# EasyEDA Pro project kod-01-akdk.eprj, board kod-01-right-pcb
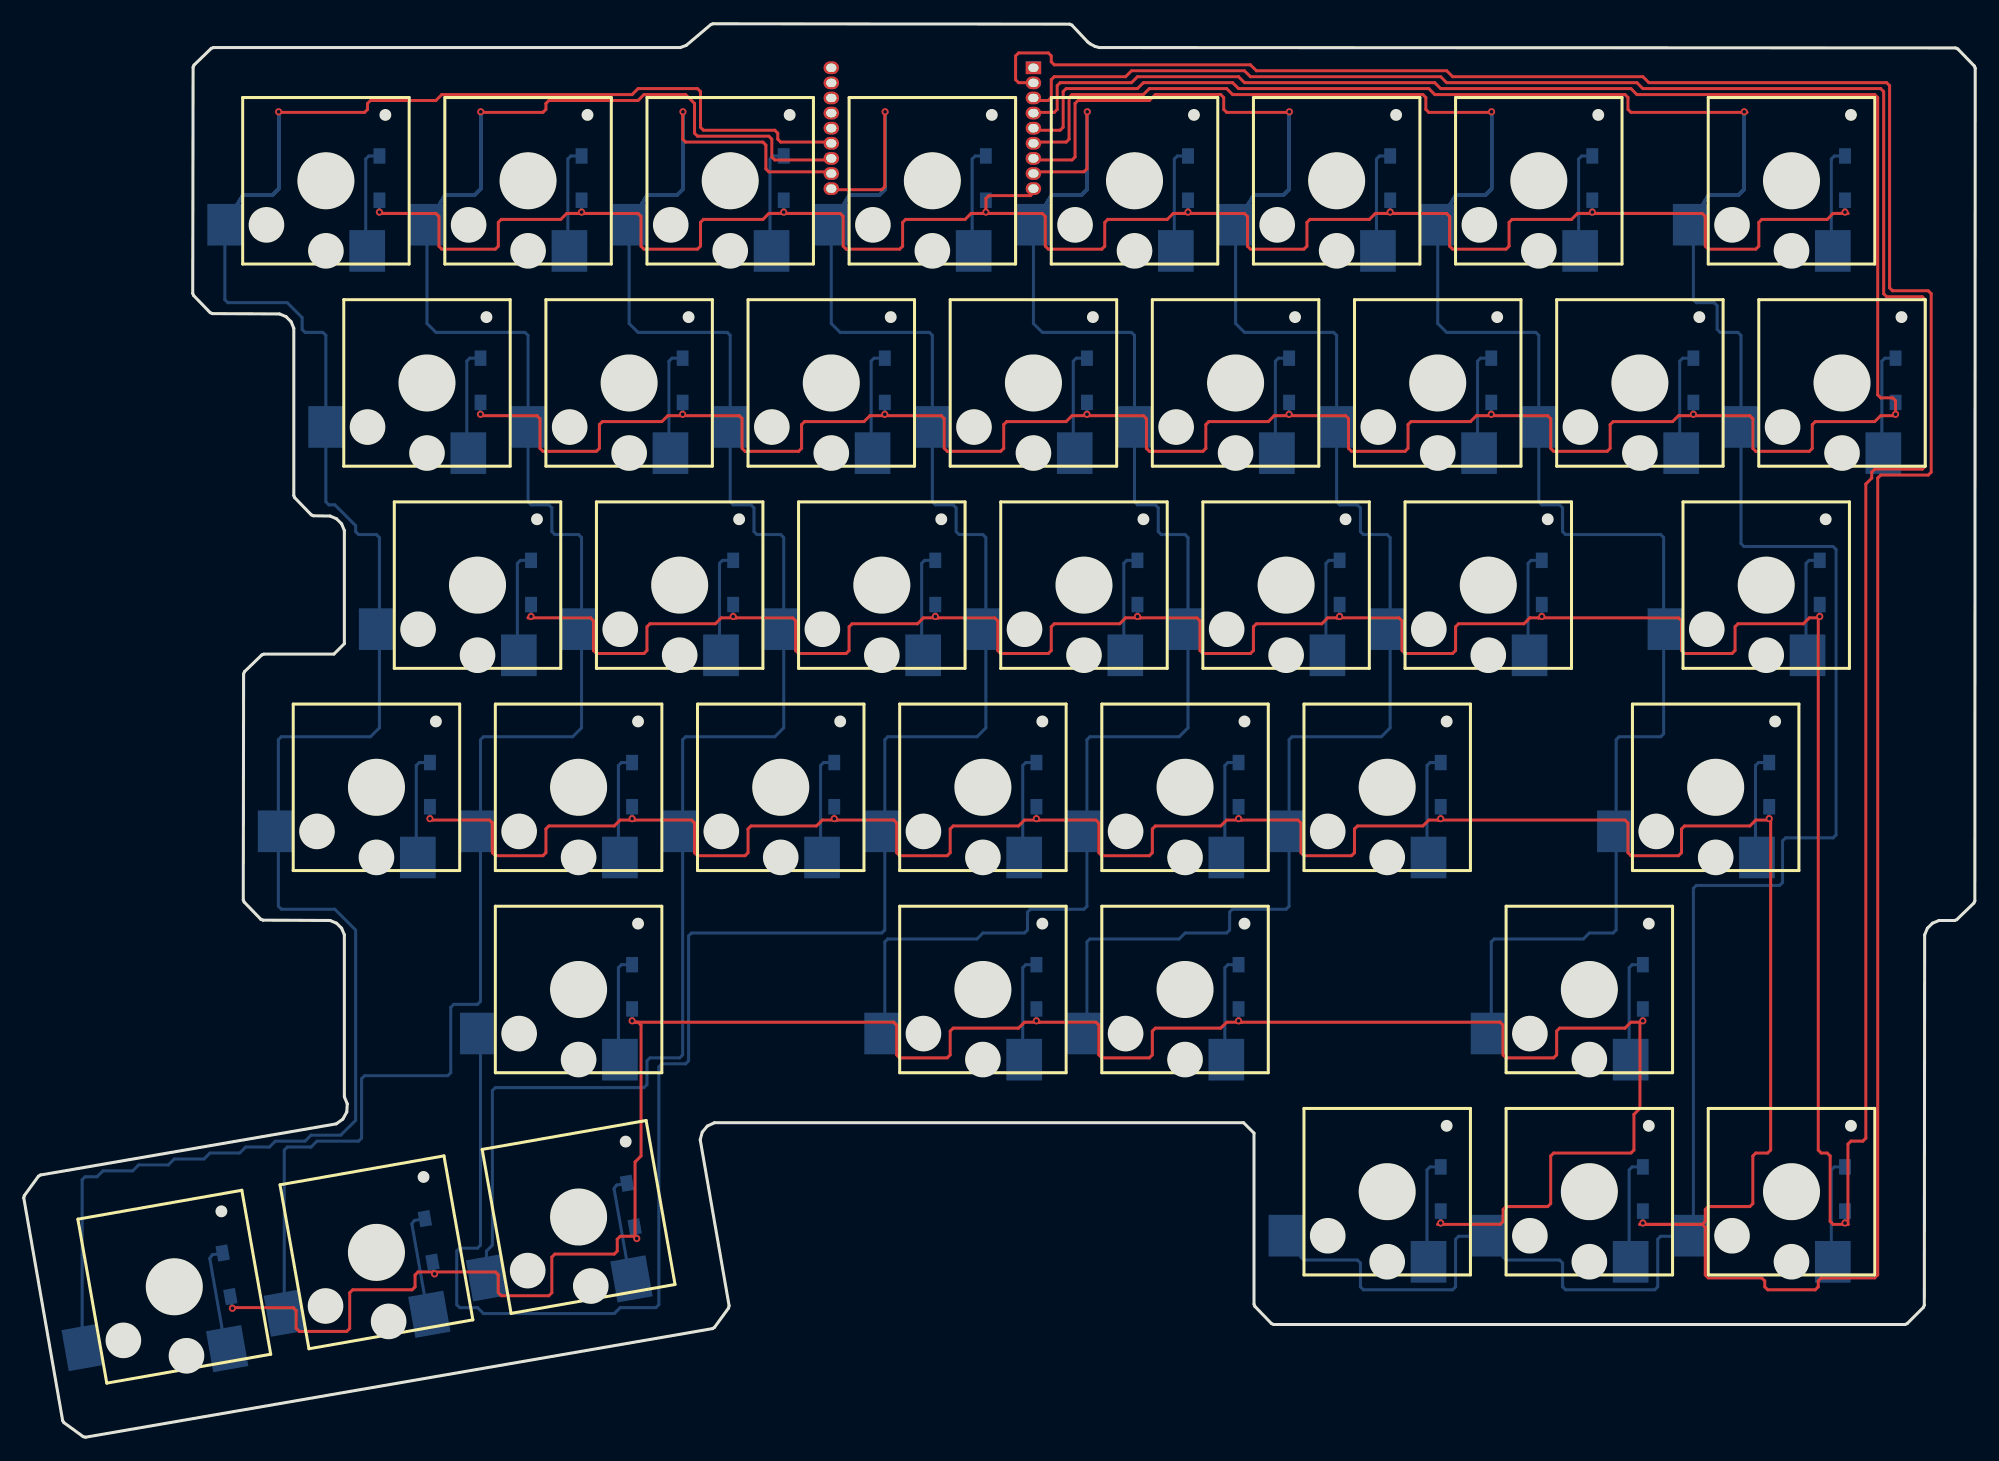
[diagram p2: board, top side]
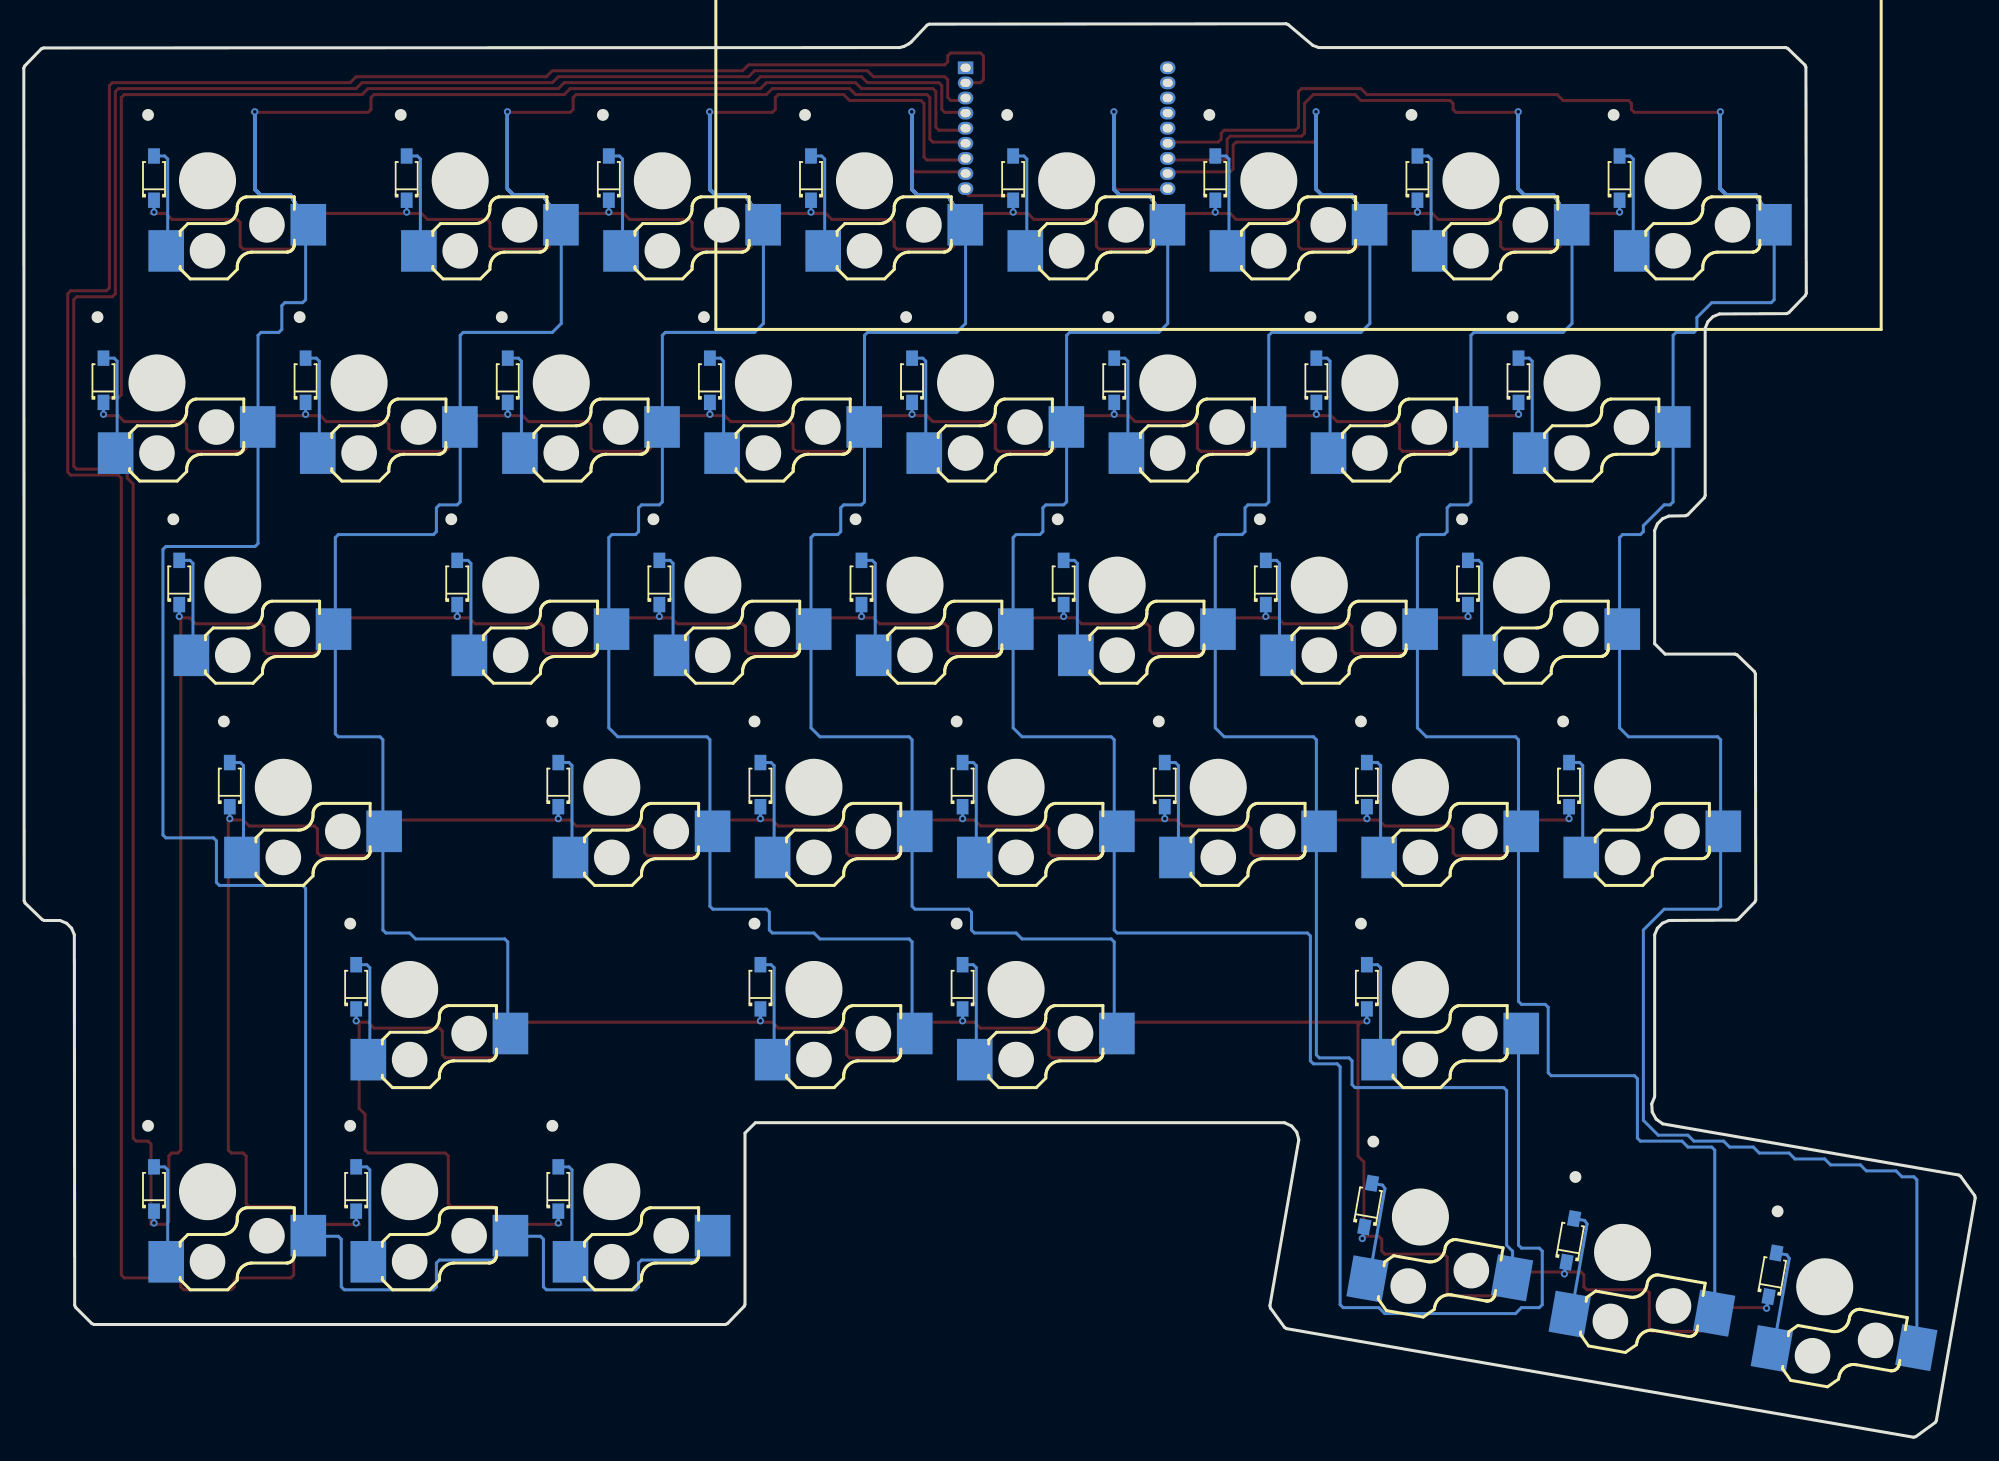
[diagram p3: board, bottom side, seen from below]

Outline 164.11 x 118.85 mm; copper layers: Top Layer, Bottom Layer. Coordinates in mm from the lower left corner of the outline.
Outline path: 0,20.12 0.05,20.32 1.23,21.94 1.4,22.05 26.27,26.35 26.83,26.74 27.16,27.35 27.2,28.03 26.98,28.58 26.96,28.68 26.96,42.24 26.73,42.8 26.3,43.22 25.76,43.45 20.11,43.48 19.93,43.56 18.53,45 18.46,45.18 18.49,64.19 18.57,64.38 20.01,65.77 20.19,65.85 26.08,65.85 26.96,66.72 26.96,76.24 26.73,76.8 26.3,77.23 25.76,77.45 24.36,77.48 24.18,77.56 22.78,79 22.71,79.18 22.71,93.24 22.48,93.8 22.05,94.22 21.51,94.45 15.86,94.48 15.68,94.56 14.28,96 14.21,96.18 14.24,115.19 14.32,115.38 15.76,116.77 15.94,116.85 55.21,116.85 55.71,117.03 57.78,118.78 57.95,118.85 87.95,118.81 88.14,118.73 89.48,117.31 89.67,117.16 90.1,116.94 90.46,116.85 162.45,116.81 162.64,116.74 164.03,115.29 164.11,115.11 164.08,45.1 164,44.92 162.55,43.52 162.37,43.45 161.06,43.45 160.51,43.22 160.09,42.79 159.86,42.24 159.83,11.1 159.75,10.92 158.38,9.55 158.2,9.48 105.11,9.48 104.93,9.56 103.53,11 103.46,11.18 103.46,25.57 102.58,26.45 58.09,26.45 57.48,26.16 57.06,25.65 56.88,25.01 59.31,11.06 59.27,10.86 58.08,9.23 57.92,9.13 5.19,0 5,0.05 3.37,1.23 3.27,1.39 0,20.12

## Design rules (mm)
spacing Default (default): track to track 0.152, other pairs 0 to 0.152
track width Default (default): min 0.254, default 0.254, max 25.4
via Default (default): diameter min 0.61, default 0.61, max 100.025; hole min 0.305, default 0.305, max 59.995

## Placement (name value [footprint] x y rotation side)
D1  -  [1N4148W#2]  29.91 105.85 90 bottom
D2  -  [1N4148W#2]  46.91 105.85 90 bottom
D3  -  [1N4148W#2]  63.91 105.85 90 bottom
D4  -  [1N4148W#2]  80.91 105.85 90 bottom
D5  -  [1N4148W#2]  97.91 105.85 90 bottom
D6  -  [1N4148W#2]  114.91 105.85 90 bottom
D7  -  [1N4148W#2]  131.91 105.85 90 bottom
D8  -  [1N4148W#2]  153.16 105.85 90 bottom
D9  -  [1N4148W#2]  38.41 88.85 90 bottom
D10  -  [1N4148W#2]  55.41 88.85 90 bottom
D11  -  [1N4148W#2]  72.41 88.85 90 bottom
D12  -  [1N4148W#2]  89.41 88.85 90 bottom
D13  -  [1N4148W#2]  106.41 88.85 90 bottom
D14  -  [1N4148W#2]  123.41 88.85 90 bottom
D15  -  [1N4148W#2]  140.41 88.85 90 bottom
D16  -  [1N4148W#2]  157.41 88.85 90 bottom
D17  -  [1N4148W#2]  42.66 71.85 90 bottom
D18  -  [1N4148W#2]  59.66 71.85 90 bottom
D19  -  [1N4148W#2]  76.66 71.85 90 bottom
D20  -  [1N4148W#2]  93.66 71.85 90 bottom
D21  -  [1N4148W#2]  110.66 71.85 90 bottom
D22  -  [1N4148W#2]  127.66 71.85 90 bottom
D23  -  [1N4148W#2]  151.03 71.85 90 bottom
D24  -  [1N4148W#2]  153.16 20.85 90 bottom
D25  -  [1N4148W#2]  34.16 54.85 90 bottom
D26  -  [1N4148W#2]  51.16 54.85 90 bottom
D27  -  [1N4148W#2]  68.16 54.85 90 bottom
D28  -  [1N4148W#2]  85.16 54.85 90 bottom
D29  -  [1N4148W#2]  102.16 54.85 90 bottom
D30  -  [1N4148W#2]  119.16 54.85 90 bottom
D31  -  [1N4148W#2]  146.78 54.85 90 bottom
D32  -  [1N4148W#2]  136.16 20.85 90 bottom
D33  -  [1N4148W]  17.05 13.63 80 bottom
D34  -  [1N4148W]  34.05 16.52 80 bottom
D35  -  [1N4148W]  51.05 19.5 80 bottom
D36  -  [1N4148W#2]  51.16 37.85 90 bottom
D37  -  [1N4148W#2]  85.16 37.85 90 bottom
D38  -  [1N4148W#2]  102.16 37.85 90 bottom
D39  -  [1N4148W#2]  136.16 37.85 90 bottom
D40  -  [1N4148W#2]  119.16 20.85 90 bottom
SW1  -  [CPG135001S30]  22.91 100.85 180 bottom
SW2  -  [CPG135001S30]  39.91 100.85 180 bottom
SW3  -  [CPG135001S30]  56.91 100.85 180 bottom
SW4  -  [CPG135001S30]  73.91 100.85 180 bottom
SW5  -  [CPG135001S30]  90.91 100.85 180 bottom
SW6  -  [CPG135001S30]  107.91 100.85 180 bottom
SW7  -  [CPG135001S30]  124.91 100.85 180 bottom
SW8  -  [CPG135001S30]  146.16 100.85 180 bottom
SW9  -  [CPG135001S30]  31.41 83.85 180 bottom
SW10  -  [CPG135001S30]  48.41 83.85 180 bottom
SW11  -  [CPG135001S30]  65.41 83.85 180 bottom
SW12  -  [CPG135001S30]  82.41 83.85 180 bottom
SW13  -  [CPG135001S30]  99.41 83.85 180 bottom
SW14  -  [CPG135001S30]  116.41 83.85 180 bottom
SW15  -  [CPG135001S30]  133.41 83.85 180 bottom
SW16  -  [CPG135001S30]  150.41 83.85 180 bottom
SW17  -  [CPG135001S30]  35.66 66.85 180 bottom
SW18  -  [CPG135001S30]  52.66 66.85 180 bottom
SW19  -  [CPG135001S30]  69.66 66.85 180 bottom
SW20  -  [CPG135001S30]  86.66 66.85 180 bottom
SW21  -  [CPG135001S30]  103.66 66.85 180 bottom
SW22  -  [CPG135001S30]  120.66 66.85 180 bottom
SW23  -  [CPG135001S30]  144.03 66.85 180 bottom
SW24  -  [CPG135001S30]  146.16 15.85 180 bottom
SW25  -  [CPG135001S30]  27.16 49.85 180 bottom
SW26  -  [CPG135001S30]  44.16 49.85 180 bottom
SW27  -  [CPG135001S30]  61.16 49.85 180 bottom
SW28  -  [CPG135001S30]  78.16 49.85 180 bottom
SW29  -  [CPG135001S30]  95.16 49.85 180 bottom
SW30  -  [CPG135001S30]  112.16 49.85 180 bottom
SW31  -  [CPG135001S30]  139.78 49.85 180 bottom
SW32  -  [CPG135001S30]  129.16 15.85 180 bottom
SW33  -  [CPG135001S30#2]  11.03 7.49 170 bottom
SW34  -  [CPG135001S30#2]  28.03 10.38 170 bottom
SW35  -  [CPG135001S30#2]  45.03 13.36 170 bottom
SW36  -  [CPG135001S30]  44.16 32.85 180 bottom
SW37  -  [CPG135001S30]  78.16 32.85 180 bottom
SW38  -  [CPG135001S30]  95.16 32.85 180 bottom
SW39  -  [CPG135001S30]  129.16 32.85 180 bottom
SW40  -  [CPG135001S30]  112.16 15.85 180 bottom
U1  -  [MS88SF2_1-1-3-SIDE2]  84.91 115.15 0 bottom

## Footprints (pads in the part's own frame, mm; a bottom-side part is the same pattern mirrored in y, then rotated)
1N4148W
  rect 1.3x1 smd rot 20: 1(-1.724,0.627) 2(1.77,-0.644)
1N4148W#2
  rect 1.3x1 smd: 1(-1.835,0) 2(1.884,0)
CPG135001S30
  rect 3x3.5 smd: 1(5.975,1.1) 2(-5.975,-1.1)
CPG135001S30#2
  rect 3x3.5 smd rot 20: 1(5.991,-1.01) 2(-5.991,1.01)
MS88SF2_1-1-3-SIDE2
  rect 1.3x1.07 hole 0.85x0.7: 1(0,0)
  oval 1.3x1.07 hole 0.85x0.7: 2(0,1.27) 3(0,2.54) 4(0,3.81) 5(0,5.08) 6(0,6.35) 7(0,7.62) 8(0,8.89) 9(0,10.16) 10(-17,10.16) 11(-17,8.89) 12(-17,7.62) 13(-17,6.35) 14(-17,5.08) 15(-17,3.81) 16(-17,2.54) 17(-17,1.27) 18(-17,0)

## Nets
COL0: SW1.1 SW9.1 SW17.1 SW25.1 SW33.1 U1.13
COL1: SW2.1 SW10.1 SW18.1 SW26.1 SW34.1 U1.12
COL2: SW3.1 SW11.1 SW19.1 SW27.1 SW35.1 U1.11
COL3: SW4.1 SW12.1 SW20.1 SW28.1 SW36.1 U1.10
COL4: SW5.1 SW13.1 SW21.1 SW29.1 SW37.1 U1.8
COL5: SW6.1 SW14.1 SW22.1 SW30.1 SW38.1 U1.7
COL6: SW7.1 SW15.1 SW23.1 SW31.1 SW39.1 U1.6
COL7: SW8.1 SW16.1 SW24.1 SW32.1 SW40.1 U1.5
ROW0: D1.1 D2.1 D3.1 D4.1 D5.1 D6.1 D7.1 D8.1 U1.9
ROW1: D9.1 D10.1 D11.1 D12.1 D13.1 D14.1 D15.1 D16.1 U1.4
ROW2: D17.1 D18.1 D19.1 D20.1 D21.1 D22.1 D23.1 D24.1 U1.3
ROW3: D25.1 D26.1 D27.1 D28.1 D29.1 D30.1 D31.1 D32.1 U1.2
ROW4: D33.1 D34.1 D35.1 D36.1 D37.1 D38.1 D39.1 D40.1 U1.1
SW1_2: D1.2 SW1.2
SW2_2: D2.2 SW2.2
SW3_2: D3.2 SW3.2
SW4_2: D4.2 SW4.2
SW5_2: D5.2 SW5.2
SW6_2: D6.2 SW6.2
SW7_2: D7.2 SW7.2
SW8_2: D8.2 SW8.2
SW9_2: D9.2 SW9.2
SW10_2: D10.2 SW10.2
SW11_2: D11.2 SW11.2
SW12_2: D12.2 SW12.2
SW13_2: D13.2 SW13.2
SW14_2: D14.2 SW14.2
SW15_2: D15.2 SW15.2
SW16_2: D16.2 SW16.2
SW17_2: D17.2 SW17.2
SW18_2: D18.2 SW18.2
SW19_2: D19.2 SW19.2
SW20_2: D20.2 SW20.2
SW21_2: D21.2 SW21.2
SW22_2: D22.2 SW22.2
SW23_2: D23.2 SW23.2
SW24_2: D24.2 SW24.2
SW25_2: D25.2 SW25.2
SW26_2: D26.2 SW26.2
SW27_2: D27.2 SW27.2
SW28_2: D28.2 SW28.2
SW29_2: D29.2 SW29.2
SW30_2: D30.2 SW30.2
SW31_2: D31.2 SW31.2
SW32_2: D32.2 SW32.2
SW33_2: D33.2 SW33.2
SW34_2: D34.2 SW34.2
SW35_2: D35.2 SW35.2
SW36_2: D36.2 SW36.2
SW37_2: D37.2 SW37.2
SW38_2: D38.2 SW38.2
SW39_2: D39.2 SW39.2
SW40_2: D40.2 SW40.2

Pads without a net: U1 14 15 16 17 18

## Via types
v1: diameter 0.61, hole 0.305, Top Layer to Bottom Layer, 48 vias

## Routing (per net, layer and track width the routed paths; a pad name or vN(x,y) marks a point on that pad's centre or on a via; arc(x,y) is an arc through that point)
COL0: length 733.9
  Top Layer w0.254: U1.13 67.91,108.9 63.66,108.9 63.41,109.15 63.41,109.65 63.16,109.9 57.16,109.9 56.91,110.15 56.91,113.15 56.66,113.4 51.66,113.4 51.16,112.9 35.16,112.9 34.66,112.4 29.16,112.4 28.91,112.15 28.91,111.65 28.66,111.4 21.41,111.4 v1(21.43,111.45)
  Bottom Layer w0.254: 21.43,104.95 20.93,104.45 ; 21.43,104.95 20.93,104.45 ; 21.43,104.95 20.93,104.45 ; 21.43,104.95 v1(21.43,111.45) ; 21.43,104.95 v1(21.43,111.45) ; 21.43,104.95 20.93,104.45 ; 21.43,104.95 20.93,104.45 ; 21.43,104.95 20.93,104.45 ; 21.43,104.95 v1(21.43,111.45) ; 21.43,104.95 v1(21.43,111.45) ; 21.43,104.95 20.93,104.45 ; 21.43,104.95 v1(21.43,111.45) ; 21.43,104.95 20.93,104.45 ; 21.43,104.95 v1(21.43,111.45) ; 21.43,104.95 20.93,104.45 ; 21.43,104.95 20.93,104.45 ; 21.43,104.95 20.93,104.45 ; 21.43,104.95 v1(21.43,111.45) ; 21.43,104.95 v1(21.43,111.45) ; 21.43,104.95 20.93,104.45 ; 21.43,104.95 v1(21.43,111.45) ; 21.43,104.95 v1(21.43,111.45) ; 21.43,104.95 v1(21.43,111.45) ; 21.43,104.95 v1(21.43,111.45) ; 21.43,104.95 v1(21.43,111.45) ; 21.43,104.95 20.93,104.45 ; 21.43,104.95 20.93,104.45 ; 21.43,104.95 v1(21.43,111.45) ; 21.43,104.95 20.93,104.45 ; 21.43,104.95 v1(21.43,111.45) ; 21.43,104.95 v1(21.43,111.45) ; 21.43,104.95 20.93,104.45 ; 21.43,104.95 20.93,104.45 ; 21.43,104.95 v1(21.43,111.45) ; 21.43,104.95 v1(21.43,111.45) ; 21.43,104.95 20.93,104.45 ; 21.43,104.95 v1(21.43,111.45) ; 21.43,104.95 v1(21.43,111.45) ; 21.43,104.95 20.93,104.45 ; 21.43,104.95 v1(21.43,111.45) ; 21.43,104.95 20.93,104.45 ; 21.43,104.95 20.93,104.45 ; 21.43,104.95 v1(21.43,111.45) ; 21.43,104.95 v1(21.43,111.45) ; 21.43,104.95 v1(21.43,111.45) ; 21.43,104.95 20.93,104.45 ; 21.43,104.95 20.93,104.45 ; 21.43,104.95 20.93,104.45 ; 21.43,104.95 v1(21.43,111.45) ; 21.43,104.95 20.93,104.45 ; 21.43,104.95 v1(21.43,111.45) ; 21.43,104.95 v1(21.43,111.45) ; 21.43,104.95 v1(21.43,111.45) ; 21.43,104.95 20.93,104.45 ; 21.43,104.95 20.93,104.45 ; 21.43,104.95 20.93,104.45 ; 21.43,104.95 v1(21.43,111.45) ; 21.43,104.95 20.93,104.45 ; 21.43,104.95 20.93,104.45 ; 21.43,104.95 v1(21.43,111.45) ; 21.43,104.95 20.93,104.45 ; 21.43,104.95 v1(21.43,111.45) ; 21.43,104.95 20.93,104.45 ; 21.43,104.95 v1(21.43,111.45) ; 21.43,104.95 20.93,104.45 ; 21.43,104.95 v1(21.43,111.45) ; 21.43,104.95 20.93,104.45 ; 21.43,104.95 20.93,104.45 ; 21.43,104.95 v1(21.43,111.45) ; 21.43,104.95 v1(21.43,111.45) ; 21.43,104.95 20.93,104.45 ; 21.43,104.95 20.93,104.45 ; 21.43,104.95 v1(21.43,111.45) ; 21.43,104.95 v1(21.43,111.45) ; 21.43,104.95 20.93,104.45 ; 21.43,104.95 20.93,104.45 ; 21.43,104.95 v1(21.43,111.45) ; 21.43,104.95 v1(21.43,111.45) ; 21.43,104.95 20.93,104.45 ; 21.43,104.95 20.93,104.45 ; 21.43,104.95 v1(21.43,111.45) ; 21.43,104.95 20.93,104.45 ; 21.43,104.95 v1(21.43,111.45) ; 21.43,104.95 v1(21.43,111.45) ; 21.43,104.95 20.93,104.45 ; 21.43,104.95 v1(21.43,111.45) ; 20.93,104.45 18.43,104.45 ; 20.93,104.45 18.43,104.45 ; 20.93,104.45 18.43,104.45 ; 20.93,104.45 18.43,104.45 ; 20.93,104.45 18.43,104.45 ; 20.93,104.45 18.43,104.45 ; 20.93,104.45 18.43,104.45 ; 20.93,104.45 18.43,104.45 ; 20.93,104.45 18.43,104.45 ; 20.93,104.45 18.43,104.45 ; 20.93,104.45 18.43,104.45 ; 20.93,104.45 18.43,104.45 ; 20.93,104.45 18.43,104.45 ; 20.93,104.45 18.43,104.45 ; 20.93,104.45 18.43,104.45 ; 20.93,104.45 18.43,104.45 ; 20.93,104.45 18.43,104.45 ; 20.93,104.45 18.43,104.45 ; 20.93,104.45 18.43,104.45 ; 20.93,104.45 18.43,104.45 ; 20.93,104.45 18.43,104.45 ; 20.93,104.45 18.43,104.45 ; 20.93,104.45 18.43,104.45 ; 20.93,104.45 18.43,104.45 ; 20.93,104.45 18.43,104.45 ; 20.93,104.45 18.43,104.45 ; 20.93,104.45 18.43,104.45 ; 20.93,104.45 18.43,104.45 ; 20.93,104.45 18.43,104.45 ; 20.93,104.45 18.43,104.45 ; 20.93,104.45 18.43,104.45 ; 20.93,104.45 18.43,104.45 ; 20.93,104.45 18.43,104.45 ; 20.93,104.45 18.43,104.45 ; 20.93,104.45 18.43,104.45 ; 20.93,104.45 18.43,104.45 ; 20.93,104.45 18.43,104.45 ; 20.93,104.45 18.43,104.45 ; 20.93,104.45 18.43,104.45 ; 20.93,104.45 18.43,104.45 ; 20.93,104.45 18.43,104.45 ; 20.93,104.45 18.43,104.45 ; 20.93,104.45 18.43,104.45 ; 18.43,104.45 SW1.1 ; 18.43,104.45 SW1.1 ; 18.43,104.45 SW1.1 ; 18.43,104.45 SW1.1 ; 18.43,104.45 SW1.1 ; 18.43,104.45 SW1.1 ; 18.43,104.45 SW1.1 ; 18.43,104.45 SW1.1 ; 18.43,104.45 SW1.1 ; 18.43,104.45 SW1.1 ; 18.43,104.45 SW1.1 ; 18.43,104.45 SW1.1 ; 18.43,104.45 SW1.1 ; 18.43,104.45 SW1.1 ; 18.43,104.45 SW1.1 ; 18.43,104.45 SW1.1 ; 18.43,104.45 SW1.1 ; 18.43,104.45 SW1.1 ; 18.43,104.45 SW1.1 ; 18.43,104.45 SW1.1 ; 18.43,104.45 SW1.1 ; 18.43,104.45 SW1.1 ; 18.43,104.45 SW1.1 ; 18.43,104.45 SW1.1 ; 18.43,104.45 SW1.1 ; 18.43,104.45 SW1.1 ; 18.43,104.45 SW1.1 ; 18.43,104.45 SW1.1 ; 18.43,104.45 SW1.1 ; 18.43,104.45 SW1.1 ; 18.43,104.45 SW1.1 ; 18.43,104.45 SW1.1 ; 18.43,104.45 SW1.1 ; 18.43,104.45 SW1.1 ; 18.43,104.45 SW1.1 ; 18.43,104.45 SW1.1 ; 18.43,104.45 SW1.1 ; 18.43,104.45 SW1.1 ; 18.43,104.45 SW1.1 ; 18.43,104.45 SW1.1 ; 18.43,104.45 SW1.1 ; 18.43,104.45 SW1.1 ; 18.43,104.45 SW1.1 ; 25.41,84.9 SW9.1 25.41,84.9 ; 25.41,84.9 25.41,78.65 25.66,78.4 26.16,78.4 27.91,76.65 27.91,76.15 28.16,75.9 29.66,75.9 29.91,75.65 29.91,67.9 ; 25.41,84.9 25.41,92.65 25.16,92.9 23.66,92.9 23.41,93.15 23.41,94.15 22.16,95.4 17.16,95.4 16.91,95.65 16.91,101.9 SW1.1 ; 29.91,67.9 29.68,67.95 29.91,67.9 ; 29.91,67.9 29.91,59.65 29.16,58.9 21.66,58.9 21.41,58.65 21.41,50.9 ; 21.41,50.9 21.41,44.65 21.66,44.4 26.16,44.4 27.91,42.65 27.91,26.65 26.66,25.4 24.16,25.4 23.66,24.9 21.16,24.9 20.66,24.4 18.66,24.4 18.16,23.9 15.66,23.9 15.16,23.4 12.66,23.4 12.16,22.9 9.66,22.9 9.16,22.4 6.66,22.4 6.16,21.9 5.16,21.9 4.91,21.65 4.91,7.4 SW33.1 ; 21.41,50.9 21.18,50.95 21.41,50.9
COL1: length 705.7
  Top Layer w0.254: U1.12 67.91,107.4 63.16,107.4 62.91,107.65 62.91,109.15 62.66,109.4 56.66,109.4 56.41,109.65 56.41,112.15 55.66,112.9 52.16,112.9 51.66,112.4 44.16,112.4 43.91,112.15 43.91,111.65 43.66,111.4 38.41,111.4 v1(38.43,111.45)
  Bottom Layer w0.254: 37.93,104.45 35.43,104.45 ; 37.93,104.45 35.43,104.45 ; 37.93,104.45 38.43,104.95 ; 37.93,104.45 38.43,104.95 ; 37.93,104.45 35.43,104.45 ; 37.93,104.45 38.43,104.95 ; 37.93,104.45 38.43,104.95 ; 37.93,104.45 38.43,104.95 ; 37.93,104.45 35.43,104.45 ; 37.93,104.45 35.43,104.45 ; 37.93,104.45 38.43,104.95 ; 37.93,104.45 35.43,104.45 ; 37.93,104.45 35.43,104.45 ; 37.93,104.45 38.43,104.95 ; 37.93,104.45 35.43,104.45 ; 37.93,104.45 35.43,104.45 ; 37.93,104.45 35.43,104.45 ; 37.93,104.45 38.43,104.95 ; 37.93,104.45 35.43,104.45 ; 37.93,104.45 35.43,104.45 ; 37.93,104.45 35.43,104.45 ; 37.93,104.45 35.43,104.45 ; 37.93,104.45 35.43,104.45 ; 37.93,104.45 38.43,104.95 ; 37.93,104.45 38.43,104.95 ; 37.93,104.45 38.43,104.95 ; 37.93,104.45 35.43,104.45 ; 37.93,104.45 38.43,104.95 ; 37.93,104.45 35.43,104.45 ; 37.93,104.45 38.43,104.95 ; 37.93,104.45 38.43,104.95 ; 37.93,104.45 35.43,104.45 ; 37.93,104.45 35.43,104.45 ; 37.93,104.45 38.43,104.95 ; 37.93,104.45 38.43,104.95 ; 37.93,104.45 35.43,104.45 ; 37.93,104.45 38.43,104.95 ; 37.93,104.45 35.43,104.45 ; 37.93,104.45 35.43,104.45 ; 37.93,104.45 38.43,104.95 ; 37.93,104.45 38.43,104.95 ; 37.93,104.45 38.43,104.95 ; 37.93,104.45 38.43,104.95 ; 37.93,104.45 38.43,104.95 ; 37.93,104.45 38.43,104.95 ; 37.93,104.45 35.43,104.45 ; 37.93,104.45 35.43,104.45 ; 37.93,104.45 35.43,104.45 ; 37.93,104.45 35.43,104.45 ; 37.93,104.45 38.43,104.95 ; 37.93,104.45 35.43,104.45 ; 37.93,104.45 35.43,104.45 ; 37.93,104.45 35.43,104.45 ; 37.93,104.45 38.43,104.95 ; 37.93,104.45 38.43,104.95 ; 37.93,104.45 35.43,104.45 ; 37.93,104.45 38.43,104.95 ; 37.93,104.45 35.43,104.45 ; 37.93,104.45 38.43,104.95 ; 37.93,104.45 35.43,104.45 ; 37.93,104.45 38.43,104.95 ; 37.93,104.45 35.43,104.45 ; 37.93,104.45 35.43,104.45 ; 37.93,104.45 38.43,104.95 ; 37.93,104.45 35.43,104.45 ; 37.93,104.45 38.43,104.95 ; 37.93,104.45 35.43,104.45 ; 37.93,104.45 35.43,104.45 ; 37.93,104.45 35.43,104.45 ; 37.93,104.45 38.43,104.95 ; 37.93,104.45 35.43,104.45 ; 37.93,104.45 38.43,104.95 ; 37.93,104.45 38.43,104.95 ; 37.93,104.45 38.43,104.95 ; 37.93,104.45 38.43,104.95 ; 37.93,104.45 35.43,104.45 ; 37.93,104.45 38.43,104.95 ; 37.93,104.45 35.43,104.45 ; 37.93,104.45 35.43,104.45 ; 37.93,104.45 38.43,104.95 ; 37.93,104.45 38.43,104.95 ; 37.93,104.45 38.43,104.95 ; 37.93,104.45 38.43,104.95 ; 37.93,104.45 38.43,104.95 ; 37.93,104.45 35.43,104.45 ; 37.93,104.45 38.43,104.95 ; 35.43,104.45 SW2.1 ; 35.43,104.45 SW2.1 ; 35.43,104.45 SW2.1 ; 35.43,104.45 SW2.1 ; 35.43,104.45 SW2.1 ; 35.43,104.45 SW2.1 ; 35.43,104.45 SW2.1 ; 35.43,104.45 SW2.1 ; 35.43,104.45 SW2.1 ; 35.43,104.45 SW2.1 ; 35.43,104.45 SW2.1 ; 35.43,104.45 SW2.1 ; 35.43,104.45 SW2.1 ; 35.43,104.45 SW2.1 ; 35.43,104.45 SW2.1 ; 35.43,104.45 SW2.1 ; 35.43,104.45 SW2.1 ; 35.43,104.45 SW2.1 ; 35.43,104.45 SW2.1 ; 35.43,104.45 SW2.1 ; 35.43,104.45 SW2.1 ; 35.43,104.45 SW2.1 ; 35.43,104.45 SW2.1 ; 35.43,104.45 SW2.1 ; 35.43,104.45 SW2.1 ; 35.43,104.45 SW2.1 ; 35.43,104.45 SW2.1 ; 35.43,104.45 SW2.1 ; 35.43,104.45 SW2.1 ; 35.43,104.45 SW2.1 ; 35.43,104.45 SW2.1 ; 35.43,104.45 SW2.1 ; 35.43,104.45 SW2.1 ; 35.43,104.45 SW2.1 ; 35.43,104.45 SW2.1 ; 35.43,104.45 SW2.1 ; 35.43,104.45 SW2.1 ; 35.43,104.45 SW2.1 ; 35.43,104.45 SW2.1 ; 35.43,104.45 SW2.1 ; 35.43,104.45 SW2.1 ; 35.43,104.45 SW2.1 ; 35.43,104.45 SW2.1 ; SW2.1 33.91,101.9 33.91,93.65 34.66,92.9 42.16,92.9 42.41,92.65 42.41,84.9 ; 38.43,104.95 v1(38.43,111.45) ; 38.43,104.95 v1(38.43,111.45) ; 38.43,104.95 v1(38.43,111.45) ; 38.43,104.95 v1(38.43,111.45) ; 38.43,104.95 v1(38.43,111.45) ; 38.43,104.95 v1(38.43,111.45) ; 38.43,104.95 v1(38.43,111.45) ; 38.43,104.95 v1(38.43,111.45) ; 38.43,104.95 v1(38.43,111.45) ; 38.43,104.95 v1(38.43,111.45) ; 38.43,104.95 v1(38.43,111.45) ; 38.43,104.95 v1(38.43,111.45) ; 38.43,104.95 v1(38.43,111.45) ; 38.43,104.95 v1(38.43,111.45) ; 38.43,104.95 v1(38.43,111.45) ; 38.43,104.95 v1(38.43,111.45) ; 38.43,104.95 v1(38.43,111.45) ; 38.43,104.95 v1(38.43,111.45) ; 38.43,104.95 v1(38.43,111.45) ; 38.43,104.95 v1(38.43,111.45) ; 38.43,104.95 v1(38.43,111.45) ; 38.43,104.95 v1(38.43,111.45) ; 38.43,104.95 v1(38.43,111.45) ; 38.43,104.95 v1(38.43,111.45) ; 38.43,104.95 v1(38.43,111.45) ; 38.43,104.95 v1(38.43,111.45) ; 38.43,104.95 v1(38.43,111.45) ; 38.43,104.95 v1(38.43,111.45) ; 38.43,104.95 v1(38.43,111.45) ; 38.43,104.95 v1(38.43,111.45) ; 38.43,104.95 v1(38.43,111.45) ; 38.43,104.95 v1(38.43,111.45) ; 38.43,104.95 v1(38.43,111.45) ; 38.43,104.95 v1(38.43,111.45) ; 38.43,104.95 v1(38.43,111.45) ; 38.43,104.95 v1(38.43,111.45) ; 38.43,104.95 v1(38.43,111.45) ; 38.43,104.95 v1(38.43,111.45) ; 38.43,104.95 v1(38.43,111.45) ; 38.43,104.95 v1(38.43,111.45) ; 38.43,104.95 v1(38.43,111.45) ; 38.43,104.95 v1(38.43,111.45) ; 38.43,104.95 v1(38.43,111.45) ; 38.41,50.9 38.18,50.95 38.41,50.9 ; 38.41,50.9 38.41,36.65 38.16,36.4 36.16,36.4 35.91,36.15 35.91,30.65 35.66,30.4 28.66,30.4 28.41,30.15 28.41,25.15 28.16,24.9 24.66,24.9 24.16,24.4 22.16,24.4 21.91,24.15 21.91,10.4 SW34.1 ; 38.41,50.9 38.41,58.65 38.66,58.9 46.16,58.9 46.91,59.65 46.91,67.9 ; 46.91,67.9 46.68,67.95 46.91,67.9 ; 46.91,67.9 46.91,75.65 46.66,75.9 44.66,75.9 44.41,76.15 44.41,78.15 44.16,78.4 42.66,78.4 42.41,78.65 42.41,84.9 ; 42.41,84.9 SW10.1 42.41,84.9
COL2: length 685
  Top Layer w0.254: v1(55.43,111.45) 55.41,111.4 55.41,109.15 55.66,108.9 62.16,108.9 62.41,108.65 62.41,106.65 62.66,106.4 67.91,106.4 U1.11
  Bottom Layer w0.254: 54.93,104.45 52.43,104.45 ; 54.93,104.45 55.43,104.95 ; 54.93,104.45 52.43,104.45 ; 54.93,104.45 52.43,104.45 ; 54.93,104.45 52.43,104.45 ; 54.93,104.45 52.43,104.45 ; 54.93,104.45 55.43,104.95 ; 54.93,104.45 55.43,104.95 ; 54.93,104.45 52.43,104.45 ; 54.93,104.45 52.43,104.45 ; 54.93,104.45 52.43,104.45 ; 54.93,104.45 55.43,104.95 ; 54.93,104.45 52.43,104.45 ; 54.93,104.45 52.43,104.45 ; 54.93,104.45 55.43,104.95 ; 54.93,104.45 55.43,104.95 ; 54.93,104.45 55.43,104.95 ; 54.93,104.45 52.43,104.45 ; 54.93,104.45 52.43,104.45 ; 54.93,104.45 52.43,104.45 ; 54.93,104.45 52.43,104.45 ; 54.93,104.45 55.43,104.95 ; 54.93,104.45 52.43,104.45 ; 54.93,104.45 55.43,104.95 ; 54.93,104.45 55.43,104.95 ; 54.93,104.45 52.43,104.45 ; 54.93,104.45 52.43,104.45 ; 54.93,104.45 55.43,104.95 ; 54.93,104.45 52.43,104.45 ; 54.93,104.45 52.43,104.45 ; 54.93,104.45 55.43,104.95 ; 54.93,104.45 52.43,104.45 ; 54.93,104.45 52.43,104.45 ; 54.93,104.45 52.43,104.45 ; 54.93,104.45 55.43,104.95 ; 54.93,104.45 52.43,104.45 ; 54.93,104.45 55.43,104.95 ; 54.93,104.45 55.43,104.95 ; 54.93,104.45 52.43,104.45 ; 54.93,104.45 55.43,104.95 ; 54.93,104.45 55.43,104.95 ; 54.93,104.45 52.43,104.45 ; 54.93,104.45 52.43,104.45 ; 54.93,104.45 52.43,104.45 ; 54.93,104.45 52.43,104.45 ; 54.93,104.45 52.43,104.45 ; 54.93,104.45 55.43,104.95 ; 54.93,104.45 55.43,104.95 ; 54.93,104.45 55.43,104.95 ; 54.93,104.45 55.43,104.95 ; 54.93,104.45 55.43,104.95 ; 54.93,104.45 52.43,104.45 ; 54.93,104.45 55.43,104.95 ; 54.93,104.45 55.43,104.95 ; 54.93,104.45 52.43,104.45 ; 54.93,104.45 55.43,104.95 ; 54.93,104.45 55.43,104.95 ; 54.93,104.45 55.43,104.95 ; 54.93,104.45 52.43,104.45 ; 54.93,104.45 52.43,104.45 ; 54.93,104.45 52.43,104.45 ; 54.93,104.45 55.43,104.95 ; 54.93,104.45 52.43,104.45 ; 54.93,104.45 55.43,104.95 ; 54.93,104.45 55.43,104.95 ; 54.93,104.45 55.43,104.95 ; 54.93,104.45 55.43,104.95 ; 54.93,104.45 52.43,104.45 ; 54.93,104.45 52.43,104.45 ; 54.93,104.45 55.43,104.95 ; 54.93,104.45 52.43,104.45 ; 54.93,104.45 52.43,104.45 ; 54.93,104.45 55.43,104.95 ; 54.93,104.45 55.43,104.95 ; 54.93,104.45 55.43,104.95 ; 54.93,104.45 55.43,104.95 ; 54.93,104.45 52.43,104.45 ; 54.93,104.45 52.43,104.45 ; 54.93,104.45 55.43,104.95 ; 54.93,104.45 55.43,104.95 ; 54.93,104.45 55.43,104.95 ; 54.93,104.45 55.43,104.95 ; 54.93,104.45 52.43,104.45 ; 54.93,104.45 55.43,104.95 ; 54.93,104.45 52.43,104.45 ; 54.93,104.45 55.43,104.95 ; 52.43,104.45 SW3.1 ; 52.43,104.45 SW3.1 ; 52.43,104.45 SW3.1 ; 52.43,104.45 SW3.1 ; 52.43,104.45 SW3.1 ; 52.43,104.45 SW3.1 ; 52.43,104.45 SW3.1 ; 52.43,104.45 SW3.1 ; 52.43,104.45 SW3.1 ; 52.43,104.45 SW3.1 ; 52.43,104.45 SW3.1 ; 52.43,104.45 SW3.1 ; 52.43,104.45 SW3.1 ; 52.43,104.45 SW3.1 ; 52.43,104.45 SW3.1 ; 52.43,104.45 SW3.1 ; 52.43,104.45 SW3.1 ; 52.43,104.45 SW3.1 ; 52.43,104.45 SW3.1 ; 52.43,104.45 SW3.1 ; 52.43,104.45 SW3.1 ; 52.43,104.45 SW3.1 ; 52.43,104.45 SW3.1 ; 52.43,104.45 SW3.1 ; 52.43,104.45 SW3.1 ; 52.43,104.45 SW3.1 ; 52.43,104.45 SW3.1 ; 52.43,104.45 SW3.1 ; 52.43,104.45 SW3.1 ; 52.43,104.45 SW3.1 ; 52.43,104.45 SW3.1 ; 52.43,104.45 SW3.1 ; 52.43,104.45 SW3.1 ; 52.43,104.45 SW3.1 ; 52.43,104.45 SW3.1 ; 52.43,104.45 SW3.1 ; 52.43,104.45 SW3.1 ; 52.43,104.45 SW3.1 ; 52.43,104.45 SW3.1 ; 52.43,104.45 SW3.1 ; 52.43,104.45 SW3.1 ; 52.43,104.45 SW3.1 ; 52.43,104.45 SW3.1 ; v1(55.43,111.45) 55.43,104.95 ; v1(55.43,111.45) 55.43,104.95 ; v1(55.43,111.45) 55.43,104.95 ; v1(55.43,111.45) 55.43,104.95 ; v1(55.43,111.45) 55.43,104.95 ; v1(55.43,111.45) 55.43,104.95 ; v1(55.43,111.45) 55.43,104.95 ; v1(55.43,111.45) 55.43,104.95 ; v1(55.43,111.45) 55.43,104.95 ; v1(55.43,111.45) 55.43,104.95 ; v1(55.43,111.45) 55.43,104.95 ; v1(55.43,111.45) 55.43,104.95 ; v1(55.43,111.45) 55.43,104.95 ; v1(55.43,111.45) 55.43,104.95 ; v1(55.43,111.45) 55.43,104.95 ; v1(55.43,111.45) 55.43,104.95 ; v1(55.43,111.45) 55.43,104.95 ; v1(55.43,111.45) 55.43,104.95 ; v1(55.43,111.45) 55.43,104.95 ; v1(55.43,111.45) 55.43,104.95 ; v1(55.43,111.45) 55.43,104.95 ; v1(55.43,111.45) 55.43,104.95 ; v1(55.43,111.45) 55.43,104.95 ; v1(55.43,111.45) 55.43,104.95 ; v1(55.43,111.45) 55.43,104.95 ; v1(55.43,111.45) 55.43,104.95 ; v1(55.43,111.45) 55.43,104.95 ; v1(55.43,111.45) 55.43,104.95 ; v1(55.43,111.45) 55.43,104.95 ; v1(55.43,111.45) 55.43,104.95 ; v1(55.43,111.45) 55.43,104.95 ; v1(55.43,111.45) 55.43,104.95 ; v1(55.43,111.45) 55.43,104.95 ; v1(55.43,111.45) 55.43,104.95 ; v1(55.43,111.45) 55.43,104.95 ; v1(55.43,111.45) 55.43,104.95 ; v1(55.43,111.45) 55.43,104.95 ; v1(55.43,111.45) 55.43,104.95 ; v1(55.43,111.45) 55.43,104.95 ; v1(55.43,111.45) 55.43,104.95 ; v1(55.43,111.45) 55.43,104.95 ; v1(55.43,111.45) 55.43,104.95 ; v1(55.43,111.45) 55.43,104.95 ; SW3.1 50.91,101.9 50.91,93.65 51.66,92.9 59.16,92.9 59.41,92.65 59.41,84.9 ; 59.41,84.9 SW11.1 59.41,84.9 ; 59.41,84.9 59.41,78.65 59.66,78.4 61.16,78.4 61.41,78.15 61.41,76.15 61.66,75.9 63.66,75.9 63.91,75.65 63.91,67.9 ; SW35.1 38.91,13.4 38.91,15.65 39.41,16.15 39.41,29.15 39.66,29.4 52.16,29.4 52.41,29.65 52.41,31.65 52.66,31.9 55.16,31.9 55.41,32.15 55.41,50.9 ; 55.41,50.9 55.41,58.65 55.66,58.9 63.16,58.9 63.91,59.65 63.91,67.9 ; 55.41,50.9 55.18,50.95 55.41,50.9 ; 63.91,67.9 SW19.1 63.91,67.9
COL3: length 726.1
  Top Layer w0.254: v1(72.43,111.45) 72.41,111.4 72.41,105.15 72.16,104.9 67.91,104.9 U1.10
  Bottom Layer w0.254: 71.93,104.45 69.43,104.45 ; 71.93,104.45 69.43,104.45 ; 71.93,104.45 69.43,104.45 ; 71.93,104.45 72.43,104.95 ; 71.93,104.45 69.43,104.45 ; 71.93,104.45 69.43,104.45 ; 71.93,104.45 72.43,104.95 ; 71.93,104.45 72.43,104.95 ; 71.93,104.45 69.43,104.45 ; 71.93,104.45 72.43,104.95 ; 71.93,104.45 72.43,104.95 ; 71.93,104.45 69.43,104.45 ; 71.93,104.45 69.43,104.45 ; 71.93,104.45 72.43,104.95 ; 71.93,104.45 72.43,104.95 ; 71.93,104.45 72.43,104.95 ; 71.93,104.45 69.43,104.45 ; 71.93,104.45 69.43,104.45 ; 71.93,104.45 72.43,104.95 ; 71.93,104.45 69.43,104.45 ; 71.93,104.45 72.43,104.95 ; 71.93,104.45 69.43,104.45 ; 71.93,104.45 69.43,104.45 ; 71.93,104.45 72.43,104.95 ; 71.93,104.45 69.43,104.45 ; 71.93,104.45 72.43,104.95 ; 71.93,104.45 69.43,104.45 ; 71.93,104.45 72.43,104.95 ; 71.93,104.45 72.43,104.95 ; 71.93,104.45 72.43,104.95 ; 71.93,104.45 72.43,104.95 ; 71.93,104.45 69.43,104.45 ; 71.93,104.45 72.43,104.95 ; 71.93,104.45 69.43,104.45 ; 71.93,104.45 69.43,104.45 ; 71.93,104.45 72.43,104.95 ; 71.93,104.45 72.43,104.95 ; 71.93,104.45 72.43,104.95 ; 71.93,104.45 69.43,104.45 ; 71.93,104.45 72.43,104.95 ; 71.93,104.45 69.43,104.45 ; 71.93,104.45 69.43,104.45 ; 71.93,104.45 72.43,104.95 ; 71.93,104.45 72.43,104.95 ; 71.93,104.45 72.43,104.95 ; 71.93,104.45 69.43,104.45 ; 71.93,104.45 69.43,104.45 ; 71.93,104.45 72.43,104.95 ; 71.93,104.45 69.43,104.45 ; 71.93,104.45 72.43,104.95 ; 71.93,104.45 72.43,104.95 ; 71.93,104.45 69.43,104.45 ; 71.93,104.45 72.43,104.95 ; 71.93,104.45 72.43,104.95 ; 71.93,104.45 72.43,104.95 ; 71.93,104.45 72.43,104.95 ; 71.93,104.45 72.43,104.95 ; 71.93,104.45 72.43,104.95 ; 71.93,104.45 69.43,104.45 ; 71.93,104.45 69.43,104.45 ; 71.93,104.45 69.43,104.45 ; 71.93,104.45 72.43,104.95 ; 71.93,104.45 72.43,104.95 ; 71.93,104.45 69.43,104.45 ; 71.93,104.45 69.43,104.45 ; 71.93,104.45 69.43,104.45 ; 71.93,104.45 72.43,104.95 ; 71.93,104.45 69.43,104.45 ; 71.93,104.45 69.43,104.45 ; 71.93,104.45 69.43,104.45 ; 71.93,104.45 72.43,104.95 ; 71.93,104.45 72.43,104.95 ; 71.93,104.45 69.43,104.45 ; 71.93,104.45 72.43,104.95 ; 71.93,104.45 69.43,104.45 ; 71.93,104.45 69.43,104.45 ; 71.93,104.45 69.43,104.45 ; 71.93,104.45 72.43,104.95 ; 71.93,104.45 72.43,104.95 ; 71.93,104.45 69.43,104.45 ; 71.93,104.45 69.43,104.45 ; 71.93,104.45 72.43,104.95 ; 71.93,104.45 69.43,104.45 ; 71.93,104.45 72.43,104.95 ; 71.93,104.45 69.43,104.45 ; 71.93,104.45 69.43,104.45 ; 69.43,104.45 SW4.1 ; 69.43,104.45 SW4.1 ; 69.43,104.45 SW4.1 ; 69.43,104.45 SW4.1 ; 69.43,104.45 SW4.1 ; 69.43,104.45 SW4.1 ; 69.43,104.45 SW4.1 ; 69.43,104.45 SW4.1 ; 69.43,104.45 SW4.1 ; 69.43,104.45 SW4.1 ; 69.43,104.45 SW4.1 ; 69.43,104.45 SW4.1 ; 69.43,104.45 SW4.1 ; 69.43,104.45 SW4.1 ; 69.43,104.45 SW4.1 ; 69.43,104.45 SW4.1 ; 69.43,104.45 SW4.1 ; 69.43,104.45 SW4.1 ; 69.43,104.45 SW4.1 ; 69.43,104.45 SW4.1 ; 69.43,104.45 SW4.1 ; 69.43,104.45 SW4.1 ; 69.43,104.45 SW4.1 ; 69.43,104.45 SW4.1 ; 69.43,104.45 SW4.1 ; 69.43,104.45 SW4.1 ; 69.43,104.45 SW4.1 ; 69.43,104.45 SW4.1 ; 69.43,104.45 SW4.1 ; 69.43,104.45 SW4.1 ; 69.43,104.45 SW4.1 ; 69.43,104.45 SW4.1 ; 69.43,104.45 SW4.1 ; 69.43,104.45 SW4.1 ; 69.43,104.45 SW4.1 ; 69.43,104.45 SW4.1 ; 69.43,104.45 SW4.1 ; 69.43,104.45 SW4.1 ; 69.43,104.45 SW4.1 ; 69.43,104.45 SW4.1 ; 69.43,104.45 SW4.1 ; 69.43,104.45 SW4.1 ; 69.43,104.45 SW4.1 ; v1(72.43,111.45) 72.43,104.95 ; v1(72.43,111.45) 72.43,104.95 ; v1(72.43,111.45) 72.43,104.95 ; v1(72.43,111.45) 72.43,104.95 ; v1(72.43,111.45) 72.43,104.95 ; v1(72.43,111.45) 72.43,104.95 ; v1(72.43,111.45) 72.43,104.95 ; v1(72.43,111.45) 72.43,104.95 ; v1(72.43,111.45) 72.43,104.95 ; v1(72.43,111.45) 72.43,104.95 ; v1(72.43,111.45) 72.43,104.95 ; v1(72.43,111.45) 72.43,104.95 ; v1(72.43,111.45) 72.43,104.95 ; v1(72.43,111.45) 72.43,104.95 ; v1(72.43,111.45) 72.43,104.95 ; v1(72.43,111.45) 72.43,104.95 ; v1(72.43,111.45) 72.43,104.95 ; v1(72.43,111.45) 72.43,104.95 ; v1(72.43,111.45) 72.43,104.95 ; v1(72.43,111.45) 72.43,104.95 ; v1(72.43,111.45) 72.43,104.95 ; v1(72.43,111.45) 72.43,104.95 ; v1(72.43,111.45) 72.43,104.95 ; v1(72.43,111.45) 72.43,104.95 ; v1(72.43,111.45) 72.43,104.95 ; v1(72.43,111.45) 72.43,104.95 ; v1(72.43,111.45) 72.43,104.95 ; v1(72.43,111.45) 72.43,104.95 ; v1(72.43,111.45) 72.43,104.95 ; v1(72.43,111.45) 72.43,104.95 ; v1(72.43,111.45) 72.43,104.95 ; v1(72.43,111.45) 72.43,104.95 ; v1(72.43,111.45) 72.43,104.95 ; v1(72.43,111.45) 72.43,104.95 ; v1(72.43,111.45) 72.43,104.95 ; v1(72.43,111.45) 72.43,104.95 ; v1(72.43,111.45) 72.43,104.95 ; v1(72.43,111.45) 72.43,104.95 ; v1(72.43,111.45) 72.43,104.95 ; v1(72.43,111.45) 72.43,104.95 ; v1(72.43,111.45) 72.43,104.95 ; v1(72.43,111.45) 72.43,104.95 ; v1(72.43,111.45) 72.43,104.95 ; SW4.1 67.91,101.9 67.91,93.65 68.66,92.9 76.16,92.9 76.41,92.65 76.41,84.9 ; 76.41,84.9 76.41,78.65 76.66,78.4 78.16,78.4 78.41,78.15 78.41,76.15 78.66,75.9 80.66,75.9 80.91,75.65 80.91,67.9 ; 76.41,84.9 SW12.1 76.41,84.9 ; 80.91,67.9 80.91,59.65 80.16,58.9 72.66,58.9 72.41,58.65 72.41,50.9 ; 80.91,67.9 SW20.1 80.91,67.9 ; 72.41,50.9 SW28.1 72.41,50.9 ; 72.41,50.9 72.41,42.65 72.16,42.4 56.16,42.4 55.91,42.15 55.91,31.65 55.66,31.4 53.66,31.4 53.41,31.15 53.41,11.15 53.16,10.9 50.16,10.9 49.66,10.4 38.66,10.4 38.16,10.9 36.66,10.9 36.41,11.15 36.41,15.65 36.66,15.9 38.16,15.9 38.41,16.15 38.41,33.9 38.18,33.95
COL4: length 657.5
  Top Layer w0.254: v1(89.43,111.45) 89.41,111.4 89.41,106.65 89.16,106.4 84.91,106.4 U1.8
  Bottom Layer w0.254: 89.43,104.95 88.93,104.45 ; 89.43,104.95 88.93,104.45 ; 89.43,104.95 v1(89.43,111.45) ; 89.43,104.95 88.93,104.45 ; 89.43,104.95 v1(89.43,111.45) ; 89.43,104.95 v1(89.43,111.45) ; 89.43,104.95 v1(89.43,111.45) ; 89.43,104.95 88.93,104.45 ; 89.43,104.95 v1(89.43,111.45) ; 89.43,104.95 88.93,104.45 ; 89.43,104.95 v1(89.43,111.45) ; 89.43,104.95 v1(89.43,111.45) ; 89.43,104.95 v1(89.43,111.45) ; 89.43,104.95 88.93,104.45 ; 89.43,104.95 88.93,104.45 ; 89.43,104.95 v1(89.43,111.45) ; 89.43,104.95 88.93,104.45 ; 89.43,104.95 v1(89.43,111.45) ; 89.43,104.95 v1(89.43,111.45) ; 89.43,104.95 88.93,104.45 ; 89.43,104.95 88.93,104.45 ; 89.43,104.95 v1(89.43,111.45) ; 89.43,104.95 88.93,104.45 ; 89.43,104.95 88.93,104.45 ; 89.43,104.95 v1(89.43,111.45) ; 89.43,104.95 v1(89.43,111.45) ; 89.43,104.95 88.93,104.45 ; 89.43,104.95 v1(89.43,111.45) ; 89.43,104.95 v1(89.43,111.45) ; 89.43,104.95 v1(89.43,111.45) ; 89.43,104.95 v1(89.43,111.45) ; 89.43,104.95 v1(89.43,111.45) ; 89.43,104.95 v1(89.43,111.45) ; 89.43,104.95 88.93,104.45 ; 89.43,104.95 v1(89.43,111.45) ; 89.43,104.95 88.93,104.45 ; 89.43,104.95 88.93,104.45 ; 89.43,104.95 88.93,104.45 ; 89.43,104.95 88.93,104.45 ; 89.43,104.95 88.93,104.45 ; 89.43,104.95 88.93,104.45 ; 89.43,104.95 88.93,104.45 ; 89.43,104.95 88.93,104.45 ; 89.43,104.95 88.93,104.45 ; 89.43,104.95 88.93,104.45 ; 89.43,104.95 88.93,104.45 ; 89.43,104.95 88.93,104.45 ; 89.43,104.95 v1(89.43,111.45) ; 89.43,104.95 v1(89.43,111.45) ; 89.43,104.95 88.93,104.45 ; 89.43,104.95 88.93,104.45 ; 89.43,104.95 88.93,104.45 ; 89.43,104.95 v1(89.43,111.45) ; 89.43,104.95 v1(89.43,111.45) ; 89.43,104.95 88.93,104.45 ; 89.43,104.95 88.93,104.45 ; 89.43,104.95 v1(89.43,111.45) ; 89.43,104.95 v1(89.43,111.45) ; 89.43,104.95 88.93,104.45 ; 89.43,104.95 88.93,104.45 ; 89.43,104.95 88.93,104.45 ; 89.43,104.95 88.93,104.45 ; 89.43,104.95 v1(89.43,111.45) ; 89.43,104.95 88.93,104.45 ; 89.43,104.95 v1(89.43,111.45) ; 89.43,104.95 v1(89.43,111.45) ; 89.43,104.95 v1(89.43,111.45) ; 89.43,104.95 88.93,104.45 ; 89.43,104.95 v1(89.43,111.45) ; 89.43,104.95 v1(89.43,111.45) ; 89.43,104.95 v1(89.43,111.45) ; 89.43,104.95 v1(89.43,111.45) ; 89.43,104.95 88.93,104.45 ; 89.43,104.95 88.93,104.45 ; 89.43,104.95 v1(89.43,111.45) ; 89.43,104.95 v1(89.43,111.45) ; 89.43,104.95 v1(89.43,111.45) ; 89.43,104.95 88.93,104.45 ; 89.43,104.95 88.93,104.45 ; 89.43,104.95 88.93,104.45 ; 89.43,104.95 v1(89.43,111.45) ; 89.43,104.95 v1(89.43,111.45) ; 89.43,104.95 88.93,104.45 ; 89.43,104.95 v1(89.43,111.45) ; 89.43,104.95 v1(89.43,111.45) ; 89.43,104.95 v1(89.43,111.45) ; 88.93,104.45 86.43,104.45 ; 88.93,104.45 86.43,104.45 ; 88.93,104.45 86.43,104.45 ; 88.93,104.45 86.43,104.45 ; 88.93,104.45 86.43,104.45 ; 88.93,104.45 86.43,104.45 ; 88.93,104.45 86.43,104.45 ; 88.93,104.45 86.43,104.45 ; 88.93,104.45 86.43,104.45 ; 88.93,104.45 86.43,104.45 ; 88.93,104.45 86.43,104.45 ; 88.93,104.45 86.43,104.45 ; 88.93,104.45 86.43,104.45 ; 88.93,104.45 86.43,104.45 ; 88.93,104.45 86.43,104.45 ; 88.93,104.45 86.43,104.45 ; 88.93,104.45 86.43,104.45 ; 88.93,104.45 86.43,104.45 ; 88.93,104.45 86.43,104.45 ; 88.93,104.45 86.43,104.45 ; 88.93,104.45 86.43,104.45 ; 88.93,104.45 86.43,104.45 ; 88.93,104.45 86.43,104.45 ; 88.93,104.45 86.43,104.45 ; 88.93,104.45 86.43,104.45 ; 88.93,104.45 86.43,104.45 ; 88.93,104.45 86.43,104.45 ; 88.93,104.45 86.43,104.45 ; 88.93,104.45 86.43,104.45 ; 88.93,104.45 86.43,104.45 ; 88.93,104.45 86.43,104.45 ; 88.93,104.45 86.43,104.45 ; 88.93,104.45 86.43,104.45 ; 88.93,104.45 86.43,104.45 ; 88.93,104.45 86.43,104.45 ; 88.93,104.45 86.43,104.45 ; 88.93,104.45 86.43,104.45 ; 88.93,104.45 86.43,104.45 ; 88.93,104.45 86.43,104.45 ; 88.93,104.45 86.43,104.45 ; 88.93,104.45 86.43,104.45 ; 88.93,104.45 86.43,104.45 ; 88.93,104.45 86.43,104.45 ; 86.43,104.45 SW5.1 ; 86.43,104.45 SW5.1 ; 86.43,104.45 SW5.1 ; 86.43,104.45 SW5.1 ; 86.43,104.45 SW5.1 ; 86.43,104.45 SW5.1 ; 86.43,104.45 SW5.1 ; 86.43,104.45 SW5.1 ; 86.43,104.45 SW5.1 ; 86.43,104.45 SW5.1 ; 86.43,104.45 SW5.1 ; 86.43,104.45 SW5.1 ; 86.43,104.45 SW5.1 ; 86.43,104.45 SW5.1 ; 86.43,104.45 SW5.1 ; 86.43,104.45 SW5.1 ; 86.43,104.45 SW5.1 ; 86.43,104.45 SW5.1 ; 86.43,104.45 SW5.1 ; 86.43,104.45 SW5.1 ; 86.43,104.45 SW5.1 ; 86.43,104.45 SW5.1 ; 86.43,104.45 SW5.1 ; 86.43,104.45 SW5.1 ; 86.43,104.45 SW5.1 ; 86.43,104.45 SW5.1 ; 86.43,104.45 SW5.1 ; 86.43,104.45 SW5.1 ; 86.43,104.45 SW5.1 ; 86.43,104.45 SW5.1 ; 86.43,104.45 SW5.1 ; 86.43,104.45 SW5.1 ; 86.43,104.45 SW5.1 ; 86.43,104.45 SW5.1 ; 86.43,104.45 SW5.1 ; 86.43,104.45 SW5.1 ; 86.43,104.45 SW5.1 ; 86.43,104.45 SW5.1 ; 86.43,104.45 SW5.1 ; 86.43,104.45 SW5.1 ; 86.43,104.45 SW5.1 ; 86.43,104.45 SW5.1 ; 86.43,104.45 SW5.1 ; SW5.1 84.91,101.9 84.91,93.65 85.66,92.9 93.16,92.9 93.41,92.65 93.41,84.9 ; 89.41,50.9 89.41,58.65 89.66,58.9 97.16,58.9 97.91,59.65 97.91,67.9 ; 89.41,50.9 89.41,44.65 89.16,44.4 84.66,44.4 84.41,44.15 84.41,42.65 84.16,42.4 80.66,42.4 80.16,41.9 72.66,41.9 72.41,41.65 72.41,33.9 SW37.1 ; 89.41,50.9 SW29.1 89.41,50.9 ; 93.41,84.9 SW13.1 93.41,84.9 ; 93.41,84.9 93.41,78.65 93.66,78.4 95.16,78.4 95.41,78.15 95.41,76.15 95.66,75.9 97.66,75.9 97.91,75.65 97.91,67.9 ; 97.91,67.9 SW21.1 97.91,67.9
COL5: length 675.8
  Top Layer w0.254: U1.7 84.91,107.4 88.16,107.4 88.41,107.65 88.41,112.15 88.66,112.4 94.66,112.4 95.16,112.9 100.66,112.9 100.91,112.65 100.91,111.65 101.16,111.4 106.41,111.4 v1(106.43,111.45)
  Bottom Layer w0.254: v1(106.43,111.45) 106.43,104.95 ; v1(106.43,111.45) 106.43,104.95 ; v1(106.43,111.45) 106.43,104.95 ; v1(106.43,111.45) 106.43,104.95 ; v1(106.43,111.45) 106.43,104.95 ; v1(106.43,111.45) 106.43,104.95 ; v1(106.43,111.45) 106.43,104.95 ; v1(106.43,111.45) 106.43,104.95 ; v1(106.43,111.45) 106.43,104.95 ; v1(106.43,111.45) 106.43,104.95 ; v1(106.43,111.45) 106.43,104.95 ; v1(106.43,111.45) 106.43,104.95 ; v1(106.43,111.45) 106.43,104.95 ; v1(106.43,111.45) 106.43,104.95 ; v1(106.43,111.45) 106.43,104.95 ; v1(106.43,111.45) 106.43,104.95 ; v1(106.43,111.45) 106.43,104.95 ; v1(106.43,111.45) 106.43,104.95 ; v1(106.43,111.45) 106.43,104.95 ; v1(106.43,111.45) 106.43,104.95 ; v1(106.43,111.45) 106.43,104.95 ; v1(106.43,111.45) 106.43,104.95 ; v1(106.43,111.45) 106.43,104.95 ; v1(106.43,111.45) 106.43,104.95 ; v1(106.43,111.45) 106.43,104.95 ; v1(106.43,111.45) 106.43,104.95 ; v1(106.43,111.45) 106.43,104.95 ; v1(106.43,111.45) 106.43,104.95 ; v1(106.43,111.45) 106.43,104.95 ; v1(106.43,111.45) 106.43,104.95 ; v1(106.43,111.45) 106.43,104.95 ; v1(106.43,111.45) 106.43,104.95 ; v1(106.43,111.45) 106.43,104.95 ; v1(106.43,111.45) 106.43,104.95 ; v1(106.43,111.45) 106.43,104.95 ; v1(106.43,111.45) 106.43,104.95 ; v1(106.43,111.45) 106.43,104.95 ; v1(106.43,111.45) 106.43,104.95 ; v1(106.43,111.45) 106.43,104.95 ; v1(106.43,111.45) 106.43,104.95 ; v1(106.43,111.45) 106.43,104.95 ; v1(106.43,111.45) 106.43,104.95 ; v1(106.43,111.45) 106.43,104.95 ; 106.43,104.95 105.93,104.45 ; 106.43,104.95 105.93,104.45 ; 106.43,104.95 105.93,104.45 ; 106.43,104.95 105.93,104.45 ; 106.43,104.95 105.93,104.45 ; 106.43,104.95 105.93,104.45 ; 106.43,104.95 105.93,104.45 ; 106.43,104.95 105.93,104.45 ; 106.43,104.95 105.93,104.45 ; 106.43,104.95 105.93,104.45 ; 106.43,104.95 105.93,104.45 ; 106.43,104.95 105.93,104.45 ; 106.43,104.95 105.93,104.45 ; 106.43,104.95 105.93,104.45 ; 106.43,104.95 105.93,104.45 ; 106.43,104.95 105.93,104.45 ; 106.43,104.95 105.93,104.45 ; 106.43,104.95 105.93,104.45 ; 106.43,104.95 105.93,104.45 ; 106.43,104.95 105.93,104.45 ; 106.43,104.95 105.93,104.45 ; 106.43,104.95 105.93,104.45 ; 106.43,104.95 105.93,104.45 ; 106.43,104.95 105.93,104.45 ; 106.43,104.95 105.93,104.45 ; 106.43,104.95 105.93,104.45 ; 106.43,104.95 105.93,104.45 ; 106.43,104.95 105.93,104.45 ; 106.43,104.95 105.93,104.45 ; 106.43,104.95 105.93,104.45 ; 106.43,104.95 105.93,104.45 ; 106.43,104.95 105.93,104.45 ; 106.43,104.95 105.93,104.45 ; 106.43,104.95 105.93,104.45 ; 106.43,104.95 105.93,104.45 ; 106.43,104.95 105.93,104.45 ; 106.43,104.95 105.93,104.45 ; 106.43,104.95 105.93,104.45 ; 106.43,104.95 105.93,104.45 ; 106.43,104.95 105.93,104.45 ; 106.43,104.95 105.93,104.45 ; 106.43,104.95 105.93,104.45 ; 106.43,104.95 105.93,104.45 ; 103.43,104.45 SW6.1 ; 103.43,104.45 105.93,104.45 ; 103.43,104.45 105.93,104.45 ; 103.43,104.45 105.93,104.45 ; 103.43,104.45 105.93,104.45 ; 103.43,104.45 105.93,104.45 ; 103.43,104.45 SW6.1 ; 103.43,104.45 SW6.1 ; 103.43,104.45 105.93,104.45 ; 103.43,104.45 105.93,104.45 ; 103.43,104.45 105.93,104.45 ; 103.43,104.45 SW6.1 ; 103.43,104.45 SW6.1 ; 103.43,104.45 105.93,104.45 ; 103.43,104.45 105.93,104.45 ; 103.43,104.45 SW6.1 ; 103.43,104.45 SW6.1 ; 103.43,104.45 105.93,104.45 ; 103.43,104.45 SW6.1 ; 103.43,104.45 105.93,104.45 ; 103.43,104.45 105.93,104.45 ; 103.43,104.45 105.93,104.45 ; 103.43,104.45 SW6.1 ; 103.43,104.45 SW6.1 ; 103.43,104.45 SW6.1 ; 103.43,104.45 SW6.1 ; 103.43,104.45 105.93,104.45 ; 103.43,104.45 105.93,104.45 ; 103.43,104.45 105.93,104.45 ; 103.43,104.45 SW6.1 ; 103.43,104.45 SW6.1 ; 103.43,104.45 105.93,104.45 ; 103.43,104.45 105.93,104.45 ; 103.43,104.45 105.93,104.45 ; 103.43,104.45 SW6.1 ; 103.43,104.45 105.93,104.45 ; 103.43,104.45 SW6.1 ; 103.43,104.45 SW6.1 ; 103.43,104.45 SW6.1 ; 103.43,104.45 SW6.1 ; 103.43,104.45 SW6.1 ; 103.43,104.45 105.93,104.45 ; 103.43,104.45 SW6.1 ; 103.43,104.45 105.93,104.45 ; 103.43,104.45 SW6.1 ; 103.43,104.45 105.93,104.45 ; 103.43,104.45 SW6.1 ; 103.43,104.45 105.93,104.45 ; 103.43,104.45 SW6.1 ; 103.43,104.45 105.93,104.45 ; 103.43,104.45 SW6.1 ; 103.43,104.45 105.93,104.45 ; 103.43,104.45 SW6.1 ; 103.43,104.45 105.93,104.45 ; 103.43,104.45 105.93,104.45 ; 103.43,104.45 SW6.1 ; 103.43,104.45 105.93,104.45 ; 103.43,104.45 SW6.1 ; 103.43,104.45 SW6.1 ; 103.43,104.45 105.93,104.45 ; 103.43,104.45 SW6.1 ; 103.43,104.45 105.93,104.45 ; 103.43,104.45 SW6.1 ; 103.43,104.45 SW6.1 ; 103.43,104.45 105.93,104.45 ; 103.43,104.45 105.93,104.45 ; 103.43,104.45 105.93,104.45 ; 103.43,104.45 105.93,104.45 ; 103.43,104.45 SW6.1 ; 103.43,104.45 SW6.1 ; 103.43,104.45 SW6.1 ; 103.43,104.45 SW6.1 ; 103.43,104.45 SW6.1 ; 103.43,104.45 SW6.1 ; 103.43,104.45 105.93,104.45 ; 103.43,104.45 SW6.1 ; 103.43,104.45 SW6.1 ; 103.43,104.45 105.93,104.45 ; 103.43,104.45 SW6.1 ; 103.43,104.45 SW6.1 ; 103.43,104.45 105.93,104.45 ; 103.43,104.45 SW6.1 ; 103.43,104.45 105.93,104.45 ; 103.43,104.45 105.93,104.45 ; 103.43,104.45 105.93,104.45 ; 103.43,104.45 105.93,104.45 ; SW6.1 101.91,101.9 101.91,93.65 102.66,92.9 110.16,92.9 110.41,92.65 110.41,84.9 ; 106.41,50.9 SW30.1 106.41,50.9 ; 106.41,50.9 106.41,58.65 106.66,58.9 114.16,58.9 114.91,59.65 114.91,67.9 ; 106.41,50.9 106.41,44.65 106.16,44.4 101.66,44.4 101.41,44.15 101.41,42.65 101.16,42.4 97.66,42.4 97.16,41.9 89.66,41.9 89.41,41.65 89.41,33.9 SW38.1 ; 114.91,67.9 SW22.1 114.91,67.9 ; 114.91,67.9 114.91,75.65 114.66,75.9 112.66,75.9 112.41,76.15 112.41,78.15 112.16,78.4 110.66,78.4 110.41,78.65 110.41,84.9 ; 110.41,84.9 SW14.1 110.41,84.9
COL6: length 687.1
  Top Layer w0.254: U1.6 84.91,108.9 87.66,108.9 87.91,109.15 87.91,112.65 88.16,112.9 94.16,112.9 94.66,113.4 101.16,113.4 101.66,112.9 117.66,112.9 117.91,112.65 117.91,111.65 118.16,111.4 123.41,111.4 v1(123.43,111.45)
  Bottom Layer w0.254: 127.41,84.9 127.41,92.65 127.16,92.9 119.66,92.9 118.91,93.65 118.91,101.9 SW7.1 ; 127.41,84.9 127.41,78.65 127.66,78.4 129.16,78.4 129.41,78.15 129.41,76.15 129.66,75.9 137.66,75.9 137.91,75.65 137.91,67.9 ; 127.41,84.9 SW15.1 127.41,84.9 ; 123.43,104.95 122.93,104.45 ; 123.43,104.95 v1(123.43,111.45) ; 123.43,104.95 122.93,104.45 ; 123.43,104.95 122.93,104.45 ; 123.43,104.95 122.93,104.45 ; 123.43,104.95 v1(123.43,111.45) ; 123.43,104.95 122.93,104.45 ; 123.43,104.95 v1(123.43,111.45) ; 123.43,104.95 122.93,104.45 ; 123.43,104.95 v1(123.43,111.45) ; 123.43,104.95 v1(123.43,111.45) ; 123.43,104.95 122.93,104.45 ; 123.43,104.95 v1(123.43,111.45) ; 123.43,104.95 122.93,104.45 ; 123.43,104.95 122.93,104.45 ; 123.43,104.95 122.93,104.45 ; 123.43,104.95 v1(123.43,111.45) ; 123.43,104.95 v1(123.43,111.45) ; 123.43,104.95 v1(123.43,111.45) ; 123.43,104.95 122.93,104.45 ; 123.43,104.95 v1(123.43,111.45) ; 123.43,104.95 v1(123.43,111.45) ; 123.43,104.95 v1(123.43,111.45) ; 123.43,104.95 v1(123.43,111.45) ; 123.43,104.95 122.93,104.45 ; 123.43,104.95 122.93,104.45 ; 123.43,104.95 122.93,104.45 ; 123.43,104.95 v1(123.43,111.45) ; 123.43,104.95 122.93,104.45 ; 123.43,104.95 v1(123.43,111.45) ; 123.43,104.95 122.93,104.45 ; 123.43,104.95 v1(123.43,111.45) ; 123.43,104.95 v1(123.43,111.45) ; 123.43,104.95 122.93,104.45 ; 123.43,104.95 v1(123.43,111.45) ; 123.43,104.95 122.93,104.45 ; 123.43,104.95 122.93,104.45 ; 123.43,104.95 v1(123.43,111.45) ; 123.43,104.95 v1(123.43,111.45) ; 123.43,104.95 v1(123.43,111.45) ; 123.43,104.95 v1(123.43,111.45) ; 123.43,104.95 122.93,104.45 ; 123.43,104.95 122.93,104.45 ; 123.43,104.95 v1(123.43,111.45) ; 123.43,104.95 v1(123.43,111.45) ; 123.43,104.95 v1(123.43,111.45) ; 123.43,104.95 122.93,104.45 ; 123.43,104.95 122.93,104.45 ; 123.43,104.95 122.93,104.45 ; 123.43,104.95 v1(123.43,111.45) ; 123.43,104.95 122.93,104.45 ; 123.43,104.95 122.93,104.45 ; 123.43,104.95 v1(123.43,111.45) ; 123.43,104.95 122.93,104.45 ; 123.43,104.95 v1(123.43,111.45) ; 123.43,104.95 122.93,104.45 ; 123.43,104.95 v1(123.43,111.45) ; 123.43,104.95 v1(123.43,111.45) ; 123.43,104.95 v1(123.43,111.45) ; 123.43,104.95 122.93,104.45 ; 123.43,104.95 122.93,104.45 ; 123.43,104.95 122.93,104.45 ; 123.43,104.95 v1(123.43,111.45) ; 123.43,104.95 v1(123.43,111.45) ; 123.43,104.95 122.93,104.45 ; 123.43,104.95 v1(123.43,111.45) ; 123.43,104.95 122.93,104.45 ; 123.43,104.95 v1(123.43,111.45) ; 123.43,104.95 122.93,104.45 ; 123.43,104.95 v1(123.43,111.45) ; 123.43,104.95 v1(123.43,111.45) ; 123.43,104.95 v1(123.43,111.45) ; 123.43,104.95 v1(123.43,111.45) ; 123.43,104.95 v1(123.43,111.45) ; 123.43,104.95 v1(123.43,111.45) ; 123.43,104.95 122.93,104.45 ; 123.43,104.95 122.93,104.45 ; 123.43,104.95 122.93,104.45 ; 123.43,104.95 122.93,104.45 ; 123.43,104.95 122.93,104.45 ; 123.43,104.95 122.93,104.45 ; 123.43,104.95 v1(123.43,111.45) ; 123.43,104.95 122.93,104.45 ; 123.43,104.95 122.93,104.45 ; 123.43,104.95 122.93,104.45 ; 123.43,104.95 v1(123.43,111.45) ; 122.93,104.45 120.43,104.45 ; 122.93,104.45 120.43,104.45 ; 122.93,104.45 120.43,104.45 ; 122.93,104.45 120.43,104.45 ; 122.93,104.45 120.43,104.45 ; 122.93,104.45 120.43,104.45 ; 122.93,104.45 120.43,104.45 ; 122.93,104.45 120.43,104.45 ; 122.93,104.45 120.43,104.45 ; 122.93,104.45 120.43,104.45 ; 122.93,104.45 120.43,104.45 ; 122.93,104.45 120.43,104.45 ; 122.93,104.45 120.43,104.45 ; 122.93,104.45 120.43,104.45 ; 122.93,104.45 120.43,104.45 ; 122.93,104.45 120.43,104.45 ; 122.93,104.45 120.43,104.45 ; 122.93,104.45 120.43,104.45 ; 122.93,104.45 120.43,104.45 ; 122.93,104.45 120.43,104.45 ; 122.93,104.45 120.43,104.45 ; 122.93,104.45 120.43,104.45 ; 122.93,104.45 120.43,104.45 ; 122.93,104.45 120.43,104.45 ; 122.93,104.45 120.43,104.45 ; 122.93,104.45 120.43,104.45 ; 122.93,104.45 120.43,104.45 ; 122.93,104.45 120.43,104.45 ; 122.93,104.45 120.43,104.45 ; 122.93,104.45 120.43,104.45 ; 122.93,104.45 120.43,104.45 ; 122.93,104.45 120.43,104.45 ; 122.93,104.45 120.43,104.45 ; 122.93,104.45 120.43,104.45 ; 122.93,104.45 120.43,104.45 ; 122.93,104.45 120.43,104.45 ; 122.93,104.45 120.43,104.45 ; 122.93,104.45 120.43,104.45 ; 122.93,104.45 120.43,104.45 ; 122.93,104.45 120.43,104.45 ; 122.93,104.45 120.43,104.45 ; 122.93,104.45 120.43,104.45 ; 122.93,104.45 120.43,104.45 ; 120.43,104.45 SW7.1 ; 120.43,104.45 SW7.1 ; 120.43,104.45 SW7.1 ; 120.43,104.45 SW7.1 ; 120.43,104.45 SW7.1 ; 120.43,104.45 SW7.1 ; 120.43,104.45 SW7.1 ; 120.43,104.45 SW7.1 ; 120.43,104.45 SW7.1 ; 120.43,104.45 SW7.1 ; 120.43,104.45 SW7.1 ; 120.43,104.45 SW7.1 ; 120.43,104.45 SW7.1 ; 120.43,104.45 SW7.1 ; 120.43,104.45 SW7.1 ; 120.43,104.45 SW7.1 ; 120.43,104.45 SW7.1 ; 120.43,104.45 SW7.1 ; 120.43,104.45 SW7.1 ; 120.43,104.45 SW7.1 ; 120.43,104.45 SW7.1 ; 120.43,104.45 SW7.1 ; 120.43,104.45 SW7.1 ; 120.43,104.45 SW7.1 ; 120.43,104.45 SW7.1 ; 120.43,104.45 SW7.1 ; 120.43,104.45 SW7.1 ; 120.43,104.45 SW7.1 ; 120.43,104.45 SW7.1 ; 120.43,104.45 SW7.1 ; 120.43,104.45 SW7.1 ; 120.43,104.45 SW7.1 ; 120.43,104.45 SW7.1 ; 120.43,104.45 SW7.1 ; 120.43,104.45 SW7.1 ; 120.43,104.45 SW7.1 ; 120.43,104.45 SW7.1 ; 120.43,104.45 SW7.1 ; 120.43,104.45 SW7.1 ; 120.43,104.45 SW7.1 ; 120.43,104.45 SW7.1 ; 120.43,104.45 SW7.1 ; 120.43,104.45 SW7.1 ; 133.91,50.9 SW31.1 133.91,50.9 ; 133.91,50.9 133.91,42.65 133.66,42.4 131.66,42.4 131.16,41.9 123.66,41.9 123.41,41.65 123.41,33.9 SW39.1 ; 133.91,50.9 133.91,58.65 134.16,58.9 137.66,58.9 137.91,59.15 137.91,67.9 ; 137.91,67.9 SW23.1 137.91,67.9
COL7: length 767.5
  Top Layer w0.254: v1(144.68,111.45) 144.91,111.4 135.16,111.4 134.91,111.65 134.91,112.65 134.66,112.9 118.66,112.9 118.16,113.4 102.16,113.4 101.66,113.9 94.16,113.9 93.66,113.4 87.66,113.4 87.41,113.15 87.41,110.15 87.16,109.9 84.91,109.9 U1.5
  Bottom Layer w0.254: 141.68,104.45 SW8.1 ; 141.68,104.45 SW8.1 ; 141.68,104.45 SW8.1 ; 141.68,104.45 144.18,104.45 ; 141.68,104.45 SW8.1 ; 141.68,104.45 144.18,104.45 ; 141.68,104.45 SW8.1 ; 141.68,104.45 SW8.1 ; 141.68,104.45 SW8.1 ; 141.68,104.45 144.18,104.45 ; 141.68,104.45 144.18,104.45 ; 141.68,104.45 144.18,104.45 ; 141.68,104.45 SW8.1 ; 141.68,104.45 SW8.1 ; 141.68,104.45 144.18,104.45 ; 141.68,104.45 SW8.1 ; 141.68,104.45 144.18,104.45 ; 141.68,104.45 144.18,104.45 ; 141.68,104.45 144.18,104.45 ; 141.68,104.45 SW8.1 ; 141.68,104.45 SW8.1 ; 141.68,104.45 144.18,104.45 ; 141.68,104.45 SW8.1 ; 141.68,104.45 144.18,104.45 ; 141.68,104.45 SW8.1 ; 141.68,104.45 SW8.1 ; 141.68,104.45 144.18,104.45 ; 141.68,104.45 SW8.1 ; 141.68,104.45 SW8.1 ; 141.68,104.45 144.18,104.45 ; 141.68,104.45 144.18,104.45 ; 141.68,104.45 144.18,104.45 ; 141.68,104.45 144.18,104.45 ; 141.68,104.45 SW8.1 ; 141.68,104.45 144.18,104.45 ; 141.68,104.45 144.18,104.45 ; 141.68,104.45 144.18,104.45 ; 141.68,104.45 144.18,104.45 ; 141.68,104.45 SW8.1 ; 141.68,104.45 144.18,104.45 ; 141.68,104.45 SW8.1 ; 141.68,104.45 144.18,104.45 ; 141.68,104.45 144.18,104.45 ; 141.68,104.45 144.18,104.45 ; 141.68,104.45 144.18,104.45 ; 141.68,104.45 SW8.1 ; 141.68,104.45 SW8.1 ; 141.68,104.45 SW8.1 ; 141.68,104.45 144.18,104.45 ; 141.68,104.45 144.18,104.45 ; 141.68,104.45 144.18,104.45 ; 141.68,104.45 144.18,104.45 ; 141.68,104.45 SW8.1 ; 141.68,104.45 SW8.1 ; 141.68,104.45 SW8.1 ; 141.68,104.45 144.18,104.45 ; 141.68,104.45 144.18,104.45 ; 141.68,104.45 SW8.1 ; 141.68,104.45 144.18,104.45 ; 141.68,104.45 SW8.1 ; 141.68,104.45 SW8.1 ; 141.68,104.45 SW8.1 ; 141.68,104.45 144.18,104.45 ; 141.68,104.45 SW8.1 ; 141.68,104.45 SW8.1 ; 141.68,104.45 144.18,104.45 ; 141.68,104.45 SW8.1 ; 141.68,104.45 144.18,104.45 ; 141.68,104.45 SW8.1 ; 141.68,104.45 SW8.1 ; 141.68,104.45 SW8.1 ; 141.68,104.45 144.18,104.45 ; 141.68,104.45 SW8.1 ; 141.68,104.45 144.18,104.45 ; 141.68,104.45 SW8.1 ; 141.68,104.45 144.18,104.45 ; 141.68,104.45 SW8.1 ; 141.68,104.45 SW8.1 ; 141.68,104.45 SW8.1 ; 141.68,104.45 144.18,104.45 ; 141.68,104.45 144.18,104.45 ; 141.68,104.45 144.18,104.45 ; 141.68,104.45 144.18,104.45 ; 141.68,104.45 SW8.1 ; 141.68,104.45 SW8.1 ; 141.68,104.45 144.18,104.45 ; SW8.1 140.41,101.9 140.41,95.65 140.66,95.4 142.16,95.4 142.41,95.15 142.41,93.15 142.66,92.9 144.16,92.9 144.41,92.65 144.41,84.9 ; 144.18,104.45 144.68,104.95 ; 144.18,104.45 144.68,104.95 ; 144.18,104.45 144.68,104.95 ; 144.18,104.45 144.68,104.95 ; 144.18,104.45 144.68,104.95 ; 144.18,104.45 144.68,104.95 ; 144.18,104.45 144.68,104.95 ; 144.18,104.45 144.68,104.95 ; 144.18,104.45 144.68,104.95 ; 144.18,104.45 144.68,104.95 ; 144.18,104.45 144.68,104.95 ; 144.18,104.45 144.68,104.95 ; 144.18,104.45 144.68,104.95 ; 144.18,104.45 144.68,104.95 ; 144.18,104.45 144.68,104.95 ; 144.18,104.45 144.68,104.95 ; 144.18,104.45 144.68,104.95 ; 144.18,104.45 144.68,104.95 ; 144.18,104.45 144.68,104.95 ; 144.18,104.45 144.68,104.95 ; 144.18,104.45 144.68,104.95 ; 144.18,104.45 144.68,104.95 ; 144.18,104.45 144.68,104.95 ; 144.18,104.45 144.68,104.95 ; 144.18,104.45 144.68,104.95 ; 144.18,104.45 144.68,104.95 ; 144.18,104.45 144.68,104.95 ; 144.18,104.45 144.68,104.95 ; 144.18,104.45 144.68,104.95 ; 144.18,104.45 144.68,104.95 ; 144.18,104.45 144.68,104.95 ; 144.18,104.45 144.68,104.95 ; 144.18,104.45 144.68,104.95 ; 144.18,104.45 144.68,104.95 ; 144.18,104.45 144.68,104.95 ; 144.18,104.45 144.68,104.95 ; 144.18,104.45 144.68,104.95 ; 144.18,104.45 144.68,104.95 ; 144.18,104.45 144.68,104.95 ; 144.18,104.45 144.68,104.95 ; 144.18,104.45 144.68,104.95 ; 144.18,104.45 144.68,104.95 ; 144.18,104.45 144.68,104.95 ; 144.68,104.95 v1(144.68,111.45) ; 144.68,104.95 v1(144.68,111.45) ; 144.68,104.95 v1(144.68,111.45) ; 144.68,104.95 v1(144.68,111.45) ; 144.68,104.95 v1(144.68,111.45) ; 144.68,104.95 v1(144.68,111.45) ; 144.68,104.95 v1(144.68,111.45) ; 144.68,104.95 v1(144.68,111.45) ; 144.68,104.95 v1(144.68,111.45) ; 144.68,104.95 v1(144.68,111.45) ; 144.68,104.95 v1(144.68,111.45) ; 144.68,104.95 v1(144.68,111.45) ; 144.68,104.95 v1(144.68,111.45) ; 144.68,104.95 v1(144.68,111.45) ; 144.68,104.95 v1(144.68,111.45) ; 144.68,104.95 v1(144.68,111.45) ; 144.68,104.95 v1(144.68,111.45) ; 144.68,104.95 v1(144.68,111.45) ; 144.68,104.95 v1(144.68,111.45) ; 144.68,104.95 v1(144.68,111.45) ; 144.68,104.95 v1(144.68,111.45) ; 144.68,104.95 v1(144.68,111.45) ; 144.68,104.95 v1(144.68,111.45) ; 144.68,104.95 v1(144.68,111.45) ; 144.68,104.95 v1(144.68,111.45) ; 144.68,104.95 v1(144.68,111.45) ; 144.68,104.95 v1(144.68,111.45) ; 144.68,104.95 v1(144.68,111.45) ; 144.68,104.95 v1(144.68,111.45) ; 144.68,104.95 v1(144.68,111.45) ; 144.68,104.95 v1(144.68,111.45) ; 144.68,104.95 v1(144.68,111.45) ; 144.68,104.95 v1(144.68,111.45) ; 144.68,104.95 v1(144.68,111.45) ; 144.68,104.95 v1(144.68,111.45) ; 144.68,104.95 v1(144.68,111.45) ; 144.68,104.95 v1(144.68,111.45) ; 144.68,104.95 v1(144.68,111.45) ; 144.68,104.95 v1(144.68,111.45) ; 144.68,104.95 v1(144.68,111.45) ; 144.68,104.95 v1(144.68,111.45) ; 144.68,104.95 v1(144.68,111.45) ; 144.68,104.95 v1(144.68,111.45) ; 123.41,16.9 124.16,16.9 124.41,16.65 124.41,15.15 124.66,14.9 129.16,14.9 129.41,14.65 129.41,12.65 129.66,12.4 137.16,12.4 137.41,12.65 137.41,16.65 137.66,16.9 140.41,16.9 ; 123.41,16.9 SW32.1 123.41,16.9 ; 123.41,16.9 120.66,16.9 120.41,16.65 120.41,12.65 120.16,12.4 112.66,12.4 112.41,12.65 112.41,14.65 112.16,14.9 107.66,14.9 107.41,15.15 107.41,16.65 107.16,16.9 106.41,16.9 SW40.1 ; 140.41,16.9 SW24.1 140.41,16.9 ; 140.41,16.9 140.41,46.15 140.66,46.4 147.66,46.4 147.91,46.65 147.91,50.15 148.16,50.4 152.16,50.4 152.41,50.65 152.41,74.65 152.16,74.9 144.66,74.9 144.41,75.15 144.41,84.9 ; 144.41,84.9 SW16.1 144.41,84.9
